# Altium project SOM Board with RK3399.PrjPcb (part 2 of 3)

## Sheet [7]-RK3399 SDRAM Page.SchDoc: RK3399 SOM Board Design V1.0
size A3; Author: ABC; Organization: Altium Limited; Address1: L3, 12a Rodborough Rd; Address2: Frenchs Forest; Address3: NSW; Address4: Australia 2086; DocumentNumber: 8; SheetNumber: 8; SheetTotal: 12; PROJECT CODE: A_V1.0
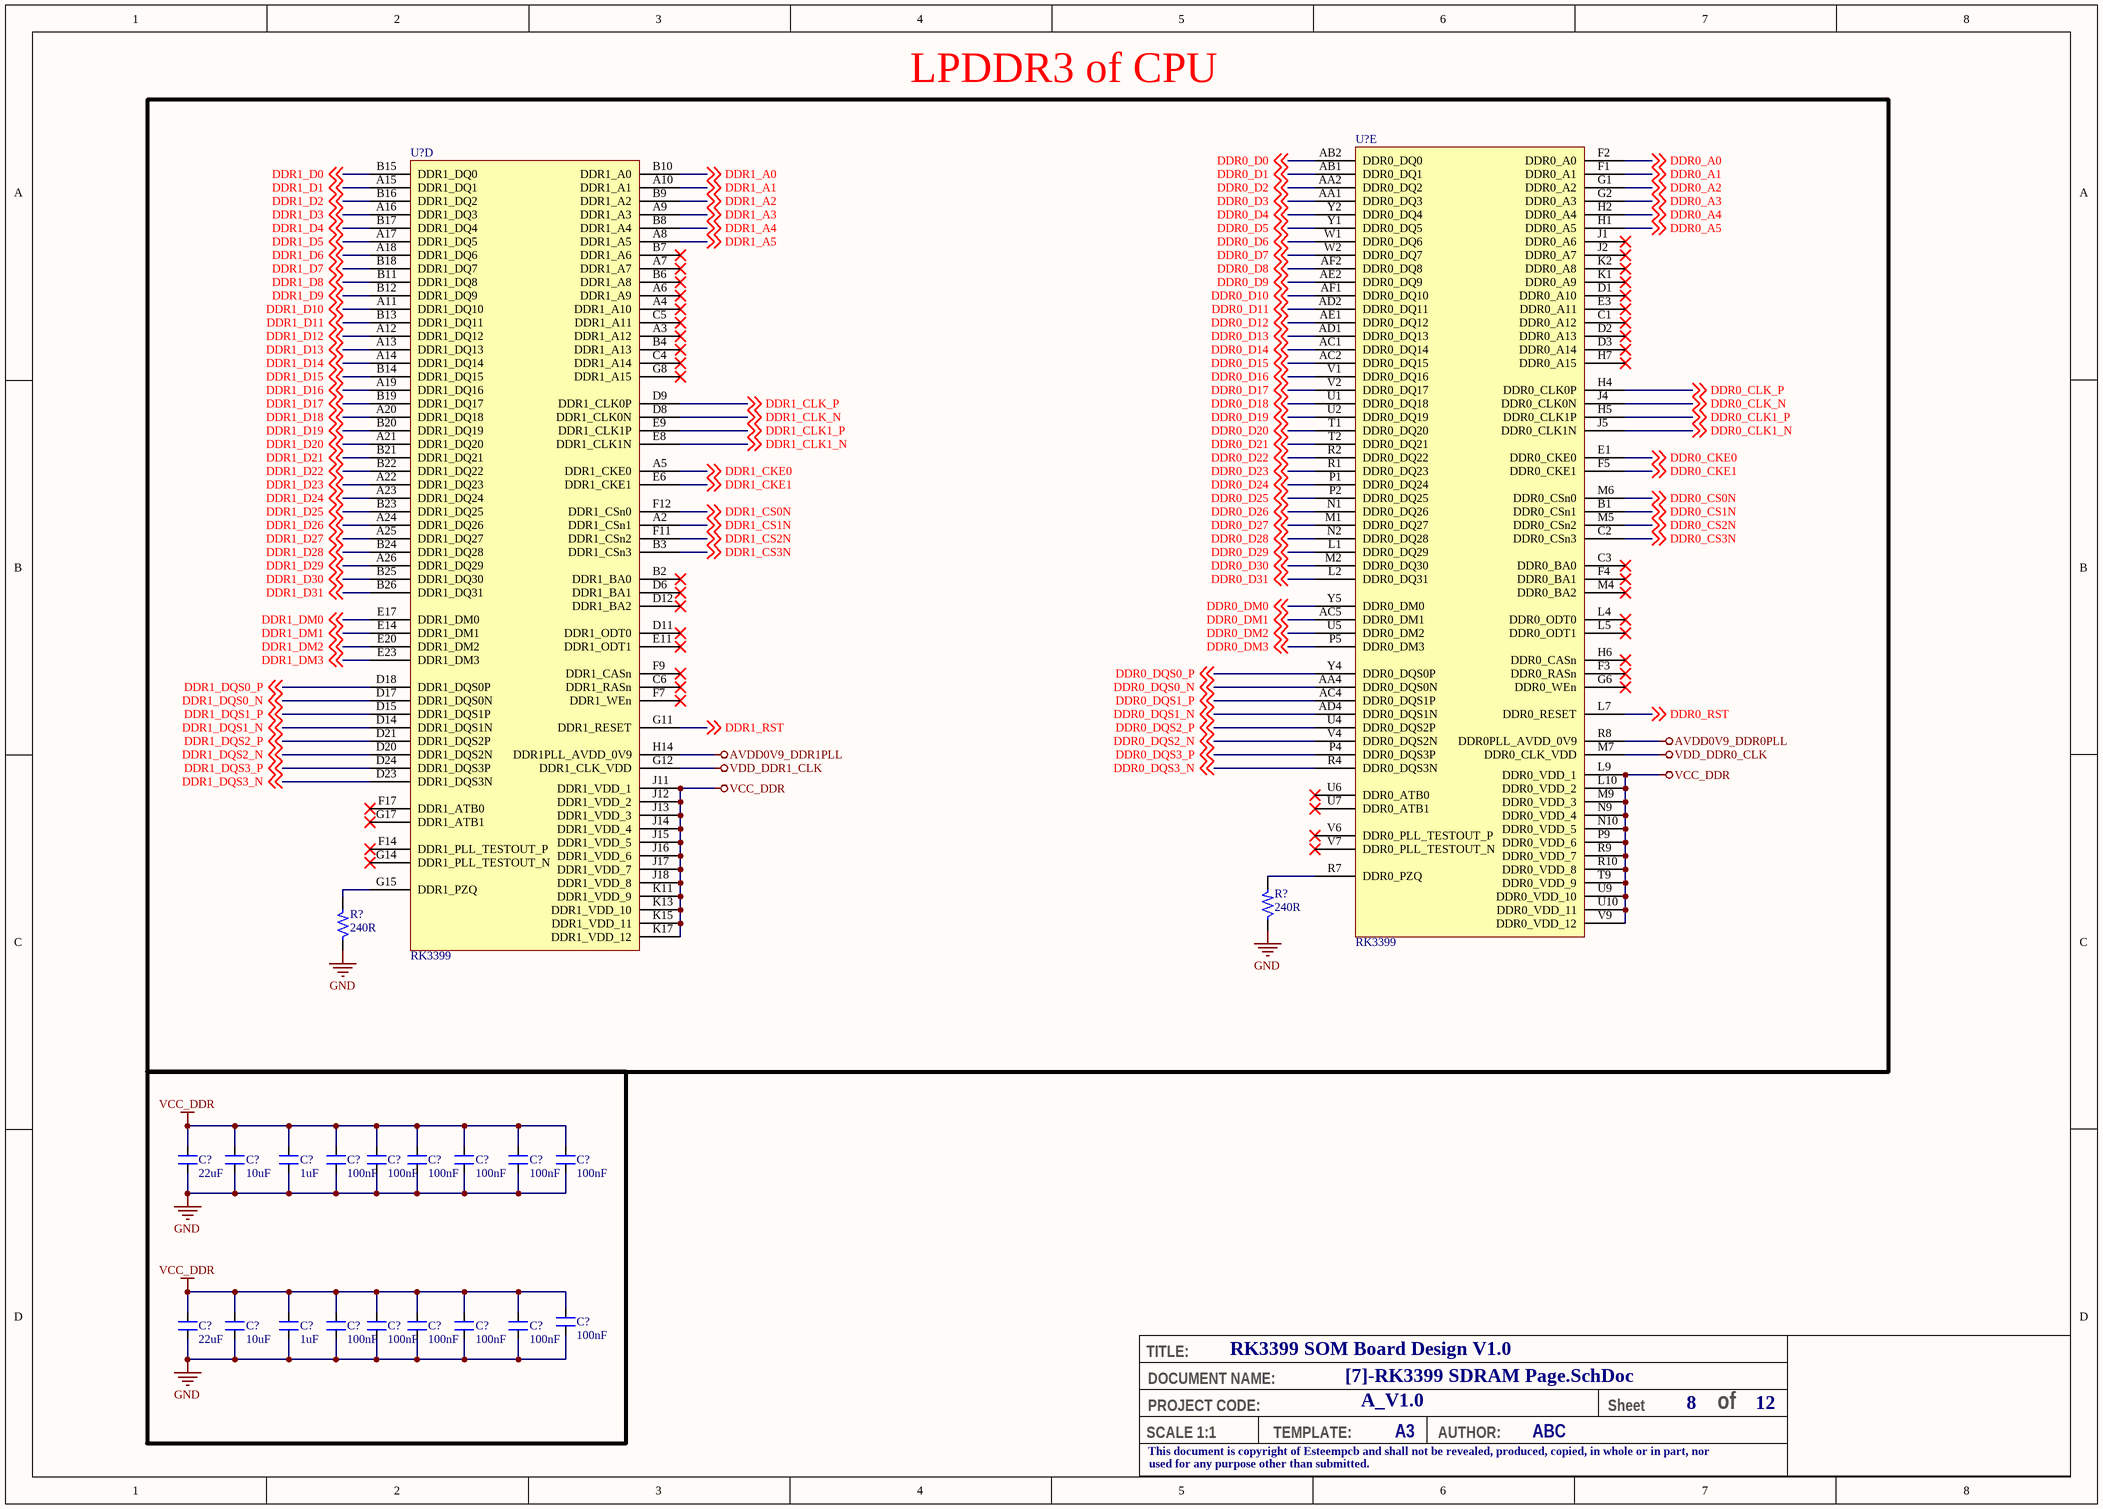
[diagram p7: [7]-RK3399 SDRAM Page.SchDoc]

### Parts
(Parts that share a designator on the sheet are numbered #1, #2 ... from top to bottom, then left to right.)
C?#101  22uF  [CAP_0402]
C?#102  10uF  [CAP_0402]
C?#103  1uF  [CAP_0201]
C?#104  100nF  [CAP_0201]
C?#105  100nF  [CAP_0201]
C?#106  100nF  [CAP_0201]
C?#107  100nF  [CAP_0201]
C?#108  100nF  [CAP_0201]
C?#109  100nF  [CAP_0201]
C?#110  100nF  [CAP_0201]
C?#111  22uF  [CAP_0402]
C?#112  10uF  [CAP_0402]
C?#113  1uF  [CAP_0201]
C?#114  100nF  [CAP_0201]
C?#115  100nF  [CAP_0201]
C?#116  100nF  [CAP_0201]
C?#117  100nF  [CAP_0201]
C?#118  100nF  [CAP_0201]
R?#45  240R  [RES_0201]
R?#46  240R  [RES_0201]
U?#22  RK3399  [FBGA828_23_826X826]  (part E of 24)
U?#23  RK3399  [FBGA828_23_826X826]  (part D of 24)

### Blocks framed on the sheet
LPDDR3 of CPU: R?#45 R?#46 U?#22 U?#23

### Nets
AVDD0V9_DDR0PLL: U?#22.R8(DDR0PLL_AVDD_0V9)
AVDD0V9_DDR1PLL: U?#23.H14(DDR1PLL_AVDD_0V9)
GND: C?#101.1 C?#102.1 C?#103.1 C?#104.1 C?#105.1 C?#106.1 C?#107.1 C?#108.1 C?#109.1 C?#110.1 C?#111.1 C?#112.1 C?#113.1 C?#114.1 C?#115.1 C?#116.1 C?#117.1 C?#118.1 R?#45.1 R?#46.1
VCC_DDR: C?#101.2 C?#102.2 C?#103.2 C?#104.2 C?#105.2 C?#106.2 C?#107.2 C?#108.2 C?#109.2 C?#110.2 C?#111.2 C?#112.2 C?#113.2 C?#114.2 C?#115.2 C?#116.2 C?#117.2 C?#118.2 U?#22.L9(DDR0_VDD_1) U?#22.L10(DDR0_VDD_2) U?#22.M9(DDR0_VDD_3) U?#22.N9(DDR0_VDD_4) U?#22.N10(DDR0_VDD_5) U?#22.P9(DDR0_VDD_6) U?#22.R9(DDR0_VDD_7) U?#22.R10(DDR0_VDD_8) U?#22.T9(DDR0_VDD_9) U?#22.U9(DDR0_VDD_10) U?#22.U10(DDR0_VDD_11) U?#22.V9(DDR0_VDD_12) U?#23.J11(DDR1_VDD_1) U?#23.J12(DDR1_VDD_2) U?#23.J13(DDR1_VDD_3) U?#23.J14(DDR1_VDD_4) U?#23.J15(DDR1_VDD_5) U?#23.J16(DDR1_VDD_6) U?#23.J17(DDR1_VDD_7) U?#23.J18(DDR1_VDD_8) U?#23.K11(DDR1_VDD_9) U?#23.K13(DDR1_VDD_10) U?#23.K15(DDR1_VDD_11) U?#23.K17(DDR1_VDD_12)
VDD_DDR0_CLK: U?#22.M7(DDR0_CLK_VDD)
VDD_DDR1_CLK: U?#23.G12(DDR1_CLK_VDD)
DDR0_A0: U?#22.F2(DDR0_A0) ; off-sheet DDR0_A0
DDR0_A1: U?#22.F1(DDR0_A1) ; off-sheet DDR0_A1
DDR0_A2: U?#22.G1(DDR0_A2) ; off-sheet DDR0_A2
DDR0_A3: U?#22.G2(DDR0_A3) ; off-sheet DDR0_A3
DDR0_A4: U?#22.H2(DDR0_A4) ; off-sheet DDR0_A4
DDR0_A5: U?#22.H1(DDR0_A5) ; off-sheet DDR0_A5
DDR0_CKE0: U?#22.E1(DDR0_CKE0) ; off-sheet DDR0_CKE0
DDR0_CKE1: U?#22.F5(DDR0_CKE1) ; off-sheet DDR0_CKE1
DDR0_CLK1_N: U?#22.J5(DDR0_CLK1N) ; off-sheet DDR0_CLK1_N
DDR0_CLK1_P: U?#22.H5(DDR0_CLK1P) ; off-sheet DDR0_CLK1_P
DDR0_CLK_N: U?#22.J4(DDR0_CLK0N) ; off-sheet DDR0_CLK_N
DDR0_CLK_P: U?#22.H4(DDR0_CLK0P) ; off-sheet DDR0_CLK_P
DDR0_CS0N: U?#22.M6(DDR0_CSn0) ; off-sheet DDR0_CS0N
DDR0_CS1N: U?#22.B1(DDR0_CSn1) ; off-sheet DDR0_CS1N
DDR0_CS2N: U?#22.M5(DDR0_CSn2) ; off-sheet DDR0_CS2N
DDR0_CS3N: U?#22.C2(DDR0_CSn3) ; off-sheet DDR0_CS3N
DDR0_D0: U?#22.AB2(DDR0_DQ0) ; off-sheet DDR0_D0
DDR0_D1: U?#22.AB1(DDR0_DQ1) ; off-sheet DDR0_D1
DDR0_D2: U?#22.AA2(DDR0_DQ2) ; off-sheet DDR0_D2
DDR0_D3: U?#22.AA1(DDR0_DQ3) ; off-sheet DDR0_D3
DDR0_D4: U?#22.Y2(DDR0_DQ4) ; off-sheet DDR0_D4
DDR0_D5: U?#22.Y1(DDR0_DQ5) ; off-sheet DDR0_D5
DDR0_D6: U?#22.W1(DDR0_DQ6) ; off-sheet DDR0_D6
DDR0_D7: U?#22.W2(DDR0_DQ7) ; off-sheet DDR0_D7
DDR0_D8: U?#22.AF2(DDR0_DQ8) ; off-sheet DDR0_D8
DDR0_D9: U?#22.AE2(DDR0_DQ9) ; off-sheet DDR0_D9
DDR0_D10: U?#22.AF1(DDR0_DQ10) ; off-sheet DDR0_D10
DDR0_D11: U?#22.AD2(DDR0_DQ11) ; off-sheet DDR0_D11
DDR0_D12: U?#22.AE1(DDR0_DQ12) ; off-sheet DDR0_D12
DDR0_D13: U?#22.AD1(DDR0_DQ13) ; off-sheet DDR0_D13
DDR0_D14: U?#22.AC1(DDR0_DQ14) ; off-sheet DDR0_D14
DDR0_D15: U?#22.AC2(DDR0_DQ15) ; off-sheet DDR0_D15
DDR0_D16: U?#22.V1(DDR0_DQ16) ; off-sheet DDR0_D16
DDR0_D17: U?#22.V2(DDR0_DQ17) ; off-sheet DDR0_D17
DDR0_D18: U?#22.U1(DDR0_DQ18) ; off-sheet DDR0_D18
DDR0_D19: U?#22.U2(DDR0_DQ19) ; off-sheet DDR0_D19
DDR0_D20: U?#22.T1(DDR0_DQ20) ; off-sheet DDR0_D20
DDR0_D21: U?#22.T2(DDR0_DQ21) ; off-sheet DDR0_D21
DDR0_D22: U?#22.R2(DDR0_DQ22) ; off-sheet DDR0_D22
DDR0_D23: U?#22.R1(DDR0_DQ23) ; off-sheet DDR0_D23
DDR0_D24: U?#22.P1(DDR0_DQ24) ; off-sheet DDR0_D24
DDR0_D25: U?#22.P2(DDR0_DQ25) ; off-sheet DDR0_D25
DDR0_D26: U?#22.N1(DDR0_DQ26) ; off-sheet DDR0_D26
DDR0_D27: U?#22.M1(DDR0_DQ27) ; off-sheet DDR0_D27
DDR0_D28: U?#22.N2(DDR0_DQ28) ; off-sheet DDR0_D28
DDR0_D29: U?#22.L1(DDR0_DQ29) ; off-sheet DDR0_D29
DDR0_D30: U?#22.M2(DDR0_DQ30) ; off-sheet DDR0_D30
DDR0_D31: U?#22.L2(DDR0_DQ31) ; off-sheet DDR0_D31
DDR0_DM0: U?#22.Y5(DDR0_DM0) ; off-sheet DDR0_DM0
DDR0_DM1: U?#22.AC5(DDR0_DM1) ; off-sheet DDR0_DM1
DDR0_DM2: U?#22.U5(DDR0_DM2) ; off-sheet DDR0_DM2
DDR0_DM3: U?#22.P5(DDR0_DM3) ; off-sheet DDR0_DM3
DDR0_DQS0_N: U?#22.AA4(DDR0_DQS0N) ; off-sheet DDR0_DQS0_N
DDR0_DQS0_P: U?#22.Y4(DDR0_DQS0P) ; off-sheet DDR0_DQS0_P
DDR0_DQS1_N: U?#22.AD4(DDR0_DQS1N) ; off-sheet DDR0_DQS1_N
DDR0_DQS1_P: U?#22.AC4(DDR0_DQS1P) ; off-sheet DDR0_DQS1_P
DDR0_DQS2_N: U?#22.V4(DDR0_DQS2N) ; off-sheet DDR0_DQS2_N
DDR0_DQS2_P: U?#22.U4(DDR0_DQS2P) ; off-sheet DDR0_DQS2_P
DDR0_DQS3_N: U?#22.R4(DDR0_DQS3N) ; off-sheet DDR0_DQS3_N
DDR0_DQS3_P: U?#22.P4(DDR0_DQS3P) ; off-sheet DDR0_DQS3_P
DDR0_RST: U?#22.L7(DDR0_RESET) ; off-sheet DDR0_RST
DDR1_A0: U?#23.B10(DDR1_A0) ; off-sheet DDR1_A0
DDR1_A1: U?#23.A10(DDR1_A1) ; off-sheet DDR1_A1
DDR1_A2: U?#23.B9(DDR1_A2) ; off-sheet DDR1_A2
DDR1_A3: U?#23.A9(DDR1_A3) ; off-sheet DDR1_A3
DDR1_A4: U?#23.B8(DDR1_A4) ; off-sheet DDR1_A4
DDR1_A5: U?#23.A8(DDR1_A5) ; off-sheet DDR1_A5
DDR1_CKE0: U?#23.A5(DDR1_CKE0) ; off-sheet DDR1_CKE0
DDR1_CKE1: U?#23.E6(DDR1_CKE1) ; off-sheet DDR1_CKE1
DDR1_CLK1_N: U?#23.E8(DDR1_CLK1N) ; off-sheet DDR1_CLK1_N
DDR1_CLK1_P: U?#23.E9(DDR1_CLK1P) ; off-sheet DDR1_CLK1_P
DDR1_CLK_N: U?#23.D8(DDR1_CLK0N) ; off-sheet DDR1_CLK_N
DDR1_CLK_P: U?#23.D9(DDR1_CLK0P) ; off-sheet DDR1_CLK_P
DDR1_CS0N: U?#23.F12(DDR1_CSn0) ; off-sheet DDR1_CS0N
DDR1_CS1N: U?#23.A2(DDR1_CSn1) ; off-sheet DDR1_CS1N
DDR1_CS2N: U?#23.F11(DDR1_CSn2) ; off-sheet DDR1_CS2N
DDR1_CS3N: U?#23.B3(DDR1_CSn3) ; off-sheet DDR1_CS3N
DDR1_D0: U?#23.B15(DDR1_DQ0) ; off-sheet DDR1_D0
DDR1_D1: U?#23.A15(DDR1_DQ1) ; off-sheet DDR1_D1
DDR1_D2: U?#23.B16(DDR1_DQ2) ; off-sheet DDR1_D2
DDR1_D3: U?#23.A16(DDR1_DQ3) ; off-sheet DDR1_D3
DDR1_D4: U?#23.B17(DDR1_DQ4) ; off-sheet DDR1_D4
DDR1_D5: U?#23.A17(DDR1_DQ5) ; off-sheet DDR1_D5
DDR1_D6: U?#23.A18(DDR1_DQ6) ; off-sheet DDR1_D6
DDR1_D7: U?#23.B18(DDR1_DQ7) ; off-sheet DDR1_D7
DDR1_D8: U?#23.B11(DDR1_DQ8) ; off-sheet DDR1_D8
DDR1_D9: U?#23.B12(DDR1_DQ9) ; off-sheet DDR1_D9
DDR1_D10: U?#23.A11(DDR1_DQ10) ; off-sheet DDR1_D10
DDR1_D11: U?#23.B13(DDR1_DQ11) ; off-sheet DDR1_D11
DDR1_D12: U?#23.A12(DDR1_DQ12) ; off-sheet DDR1_D12
DDR1_D13: U?#23.A13(DDR1_DQ13) ; off-sheet DDR1_D13
DDR1_D14: U?#23.A14(DDR1_DQ14) ; off-sheet DDR1_D14
DDR1_D15: U?#23.B14(DDR1_DQ15) ; off-sheet DDR1_D15
DDR1_D16: U?#23.A19(DDR1_DQ16) ; off-sheet DDR1_D16
DDR1_D17: U?#23.B19(DDR1_DQ17) ; off-sheet DDR1_D17
DDR1_D18: U?#23.A20(DDR1_DQ18) ; off-sheet DDR1_D18
DDR1_D19: U?#23.B20(DDR1_DQ19) ; off-sheet DDR1_D19
DDR1_D20: U?#23.A21(DDR1_DQ20) ; off-sheet DDR1_D20
DDR1_D21: U?#23.B21(DDR1_DQ21) ; off-sheet DDR1_D21
DDR1_D22: U?#23.B22(DDR1_DQ22) ; off-sheet DDR1_D22
DDR1_D23: U?#23.A22(DDR1_DQ23) ; off-sheet DDR1_D23
DDR1_D24: U?#23.A23(DDR1_DQ24) ; off-sheet DDR1_D24
DDR1_D25: U?#23.B23(DDR1_DQ25) ; off-sheet DDR1_D25
DDR1_D26: U?#23.A24(DDR1_DQ26) ; off-sheet DDR1_D26
DDR1_D27: U?#23.A25(DDR1_DQ27) ; off-sheet DDR1_D27
DDR1_D28: U?#23.B24(DDR1_DQ28) ; off-sheet DDR1_D28
DDR1_D29: U?#23.A26(DDR1_DQ29) ; off-sheet DDR1_D29
DDR1_D30: U?#23.B25(DDR1_DQ30) ; off-sheet DDR1_D30
DDR1_D31: U?#23.B26(DDR1_DQ31) ; off-sheet DDR1_D31
DDR1_DM0: U?#23.E17(DDR1_DM0) ; off-sheet DDR1_DM0
DDR1_DM1: U?#23.E14(DDR1_DM1) ; off-sheet DDR1_DM1
DDR1_DM2: U?#23.E20(DDR1_DM2) ; off-sheet DDR1_DM2
DDR1_DM3: U?#23.E23(DDR1_DM3) ; off-sheet DDR1_DM3
DDR1_DQS0_N: U?#23.D17(DDR1_DQS0N) ; off-sheet DDR1_DQS0_N
DDR1_DQS0_P: U?#23.D18(DDR1_DQS0P) ; off-sheet DDR1_DQS0_P
DDR1_DQS1_N: U?#23.D14(DDR1_DQS1N) ; off-sheet DDR1_DQS1_N
DDR1_DQS1_P: U?#23.D15(DDR1_DQS1P) ; off-sheet DDR1_DQS1_P
DDR1_DQS2_N: U?#23.D20(DDR1_DQS2N) ; off-sheet DDR1_DQS2_N
DDR1_DQS2_P: U?#23.D21(DDR1_DQS2P) ; off-sheet DDR1_DQS2_P
DDR1_DQS3_N: U?#23.D23(DDR1_DQS3N) ; off-sheet DDR1_DQS3_N
DDR1_DQS3_P: U?#23.D24(DDR1_DQS3P) ; off-sheet DDR1_DQS3_P
DDR1_RST: U?#23.G11(DDR1_RESET) ; off-sheet DDR1_RST
NetR?#45_2: R?#45.2 U?#22.R7(DDR0_PZQ)
NetR?#46_2: R?#46.2 U?#23.G15(DDR1_PZQ)

Not connected (* = marked no-connect by the designer): U?#22 C1(DDR0_A12)* C3(DDR0_BA0)* D1(DDR0_A10)* D2(DDR0_A13)* D3(DDR0_A14)* E3(DDR0_A11)* F3(DDR0_RASn)* F4(DDR0_BA1)* G6(DDR0_WEn)* H6(DDR0_CASn)* H7(DDR0_A15)* J1(DDR0_A6)* J2(DDR0_A7)* K1(DDR0_A9)* K2(DDR0_A8)* L4(DDR0_ODT0)* L5(DDR0_ODT1)* M4(DDR0_BA2)* U6(DDR0_ATB0)* U7(DDR0_ATB1)* V6(DDR0_PLL_TESTOUT_P)* V7(DDR0_PLL_TESTOUT_N)*; U?#23 A3(DDR1_A12)* A4(DDR1_A10)* A6(DDR1_A9)* A7(DDR1_A7)* B2(DDR1_BA0)* B4(DDR1_A13)* B6(DDR1_A8)* B7(DDR1_A6)* C4(DDR1_A14)* C5(DDR1_A11)* C6(DDR1_RASn)* D6(DDR1_BA1)* D11(DDR1_ODT0)* D12(DDR1_BA2)* E11(DDR1_ODT1)* F7(DDR1_WEn)* F9(DDR1_CASn)* F14(DDR1_PLL_TESTOUT_P)* F17(DDR1_ATB0)* G8(DDR1_A15)* G14(DDR1_PLL_TESTOUT_N)* G17(DDR1_ATB1)*

### Notes on the sheet
- TITLE:
- DOCUMENT NAME:
- SCALE 1:1
- This document is copyright of Esteempcb and shall not be revealed, produced, copied, in whole or in part, nor
- PROJECT CODE:
- TEMPLATE:
- A3
- AUTHOR:
- Sheet
- of
- used for any purpose other than submitted.

### Library data of the parts
C?#101 C?#111 = CAP_22uF-6.3V-20%-0402: as C?#6 on sheet [1]-Power Pins Page of RK3399; Case/Package: 0402; Supplier-1: Digikey
C?#102 C?#112 = CAP_10uF-10V-20%-0402: as C?#1 on sheet [1]-Power Pins Page of RK3399; Case/Package: 0402; Supplier-1: Digikey
C?#103 C?#113 = CAP_1uF-16V-10%-0201: as C?#8 on sheet [1]-Power Pins Page of RK3399; Case/Package: 0201; Supplier-1: Digikey
C?#104-C?#110 C?#114-C?#118 = CAP_100nF-25V-10%-0201: as C?#9 on sheet [1]-Power Pins Page of RK3399; Case/Package: 0201; Supplier-1: Digikey
R?#45 R?#46 = RES_240R-0.05W-1%-0201: 240 Ohms ±1% 0.05W, 1/20W Chip Resistor 0201 (0603 Metric) Thick Film /; Manufacturer: Yageo; Manufacturer Part Number: RC0201FR-07240RL; Case/Package: 0201; Supplier-1: Digikey
U?#22 U?#23 = IC_RK3399-FCBGA828: RK3399 is a low power, high performance processor for computing, personal mobile.; Manufacturer: Rockchip; Manufacturer Part Number: RK3399; Case/Package: FCBGA828; Supplier-1: Rockchip

## Sheet [8]-LPDDR4 SDRAM-1.SchDoc: RK3399 SOM Board Design V1.0
size A3; Author: ABC; Organization: Altium Limited; Address1: L3, 12a Rodborough Rd; Address2: Frenchs Forest; Address3: NSW; Address4: Australia 2086; DocumentNumber: 9; SheetNumber: 9; SheetTotal: 12; PROJECT CODE: A_V1.0
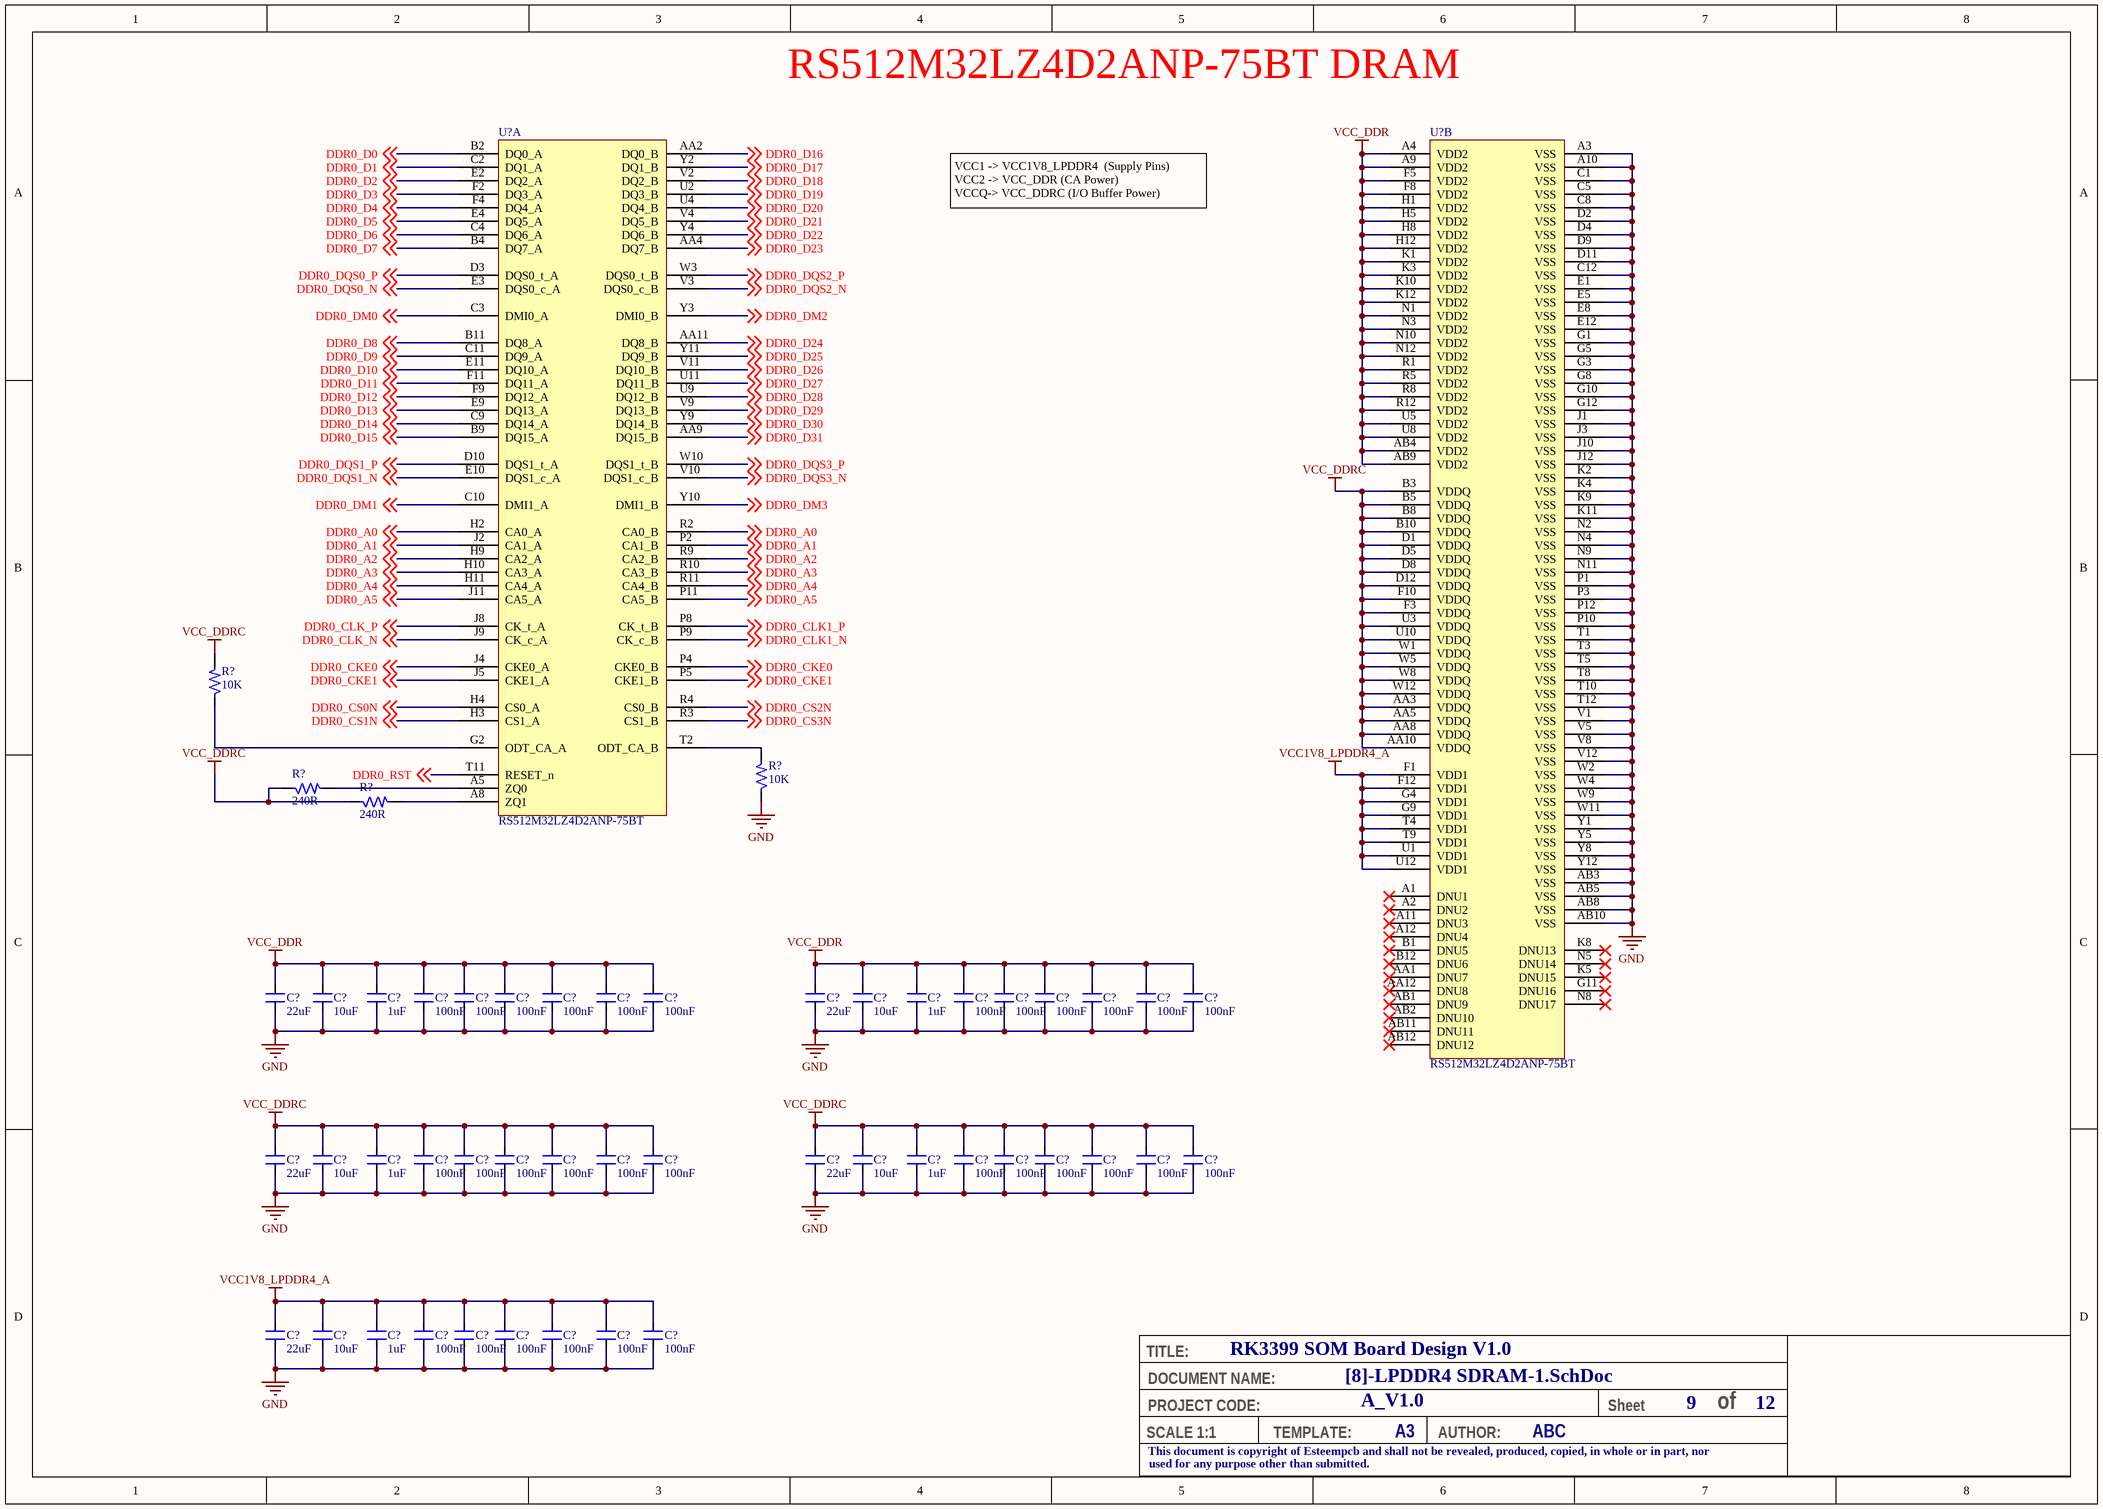
[diagram p8: [8]-LPDDR4 SDRAM-1.SchDoc]

### Parts
(Parts that share a designator on the sheet are numbered #1, #2 ... from top to bottom, then left to right.)
C?#119  22uF  [CAP_0402]
C?#120  10uF  [CAP_0402]
C?#121  1uF  [CAP_0201]
C?#122  100nF  [CAP_0201]
C?#123  100nF  [CAP_0201]
C?#124  100nF  [CAP_0201]
C?#125  100nF  [CAP_0201]
C?#126  100nF  [CAP_0201]
C?#127  100nF  [CAP_0201]
C?#128  22uF  [CAP_0402]
C?#129  10uF  [CAP_0402]
C?#130  1uF  [CAP_0201]
C?#131  100nF  [CAP_0201]
C?#132  100nF  [CAP_0201]
C?#133  100nF  [CAP_0201]
C?#134  100nF  [CAP_0201]
C?#135  100nF  [CAP_0201]
C?#136  100nF  [CAP_0201]
C?#137  22uF  [CAP_0402]
C?#138  10uF  [CAP_0402]
C?#139  1uF  [CAP_0201]
C?#140  100nF  [CAP_0201]
C?#141  100nF  [CAP_0201]
C?#142  100nF  [CAP_0201]
C?#143  100nF  [CAP_0201]
C?#144  100nF  [CAP_0201]
C?#145  100nF  [CAP_0201]
C?#146  22uF  [CAP_0402]
C?#147  10uF  [CAP_0402]
C?#148  1uF  [CAP_0201]
C?#149  100nF  [CAP_0201]
C?#150  100nF  [CAP_0201]
C?#151  100nF  [CAP_0201]
C?#152  100nF  [CAP_0201]
C?#153  100nF  [CAP_0201]
C?#154  100nF  [CAP_0201]
C?#155  22uF  [CAP_0402]
C?#156  10uF  [CAP_0402]
C?#157  1uF  [CAP_0201]
C?#158  100nF  [CAP_0201]
C?#159  100nF  [CAP_0201]
C?#160  100nF  [CAP_0201]
C?#161  100nF  [CAP_0201]
C?#162  100nF  [CAP_0201]
C?#163  100nF  [CAP_0201]
R?#47  10K  [RES_0201]
R?#48  240R  [RES_0201]
R?#49  240R  [RES_0201]
R?#50  10K  [RES_0201]
U?#24  RS512M32LZ4D2ANP-75BT  [FBGA200_SMD]  (part A of 2)
U?#25  RS512M32LZ4D2ANP-75BT  [FBGA200_SMD]  (part B of 2)

### Nets
GND: C?#119.1 C?#120.1 C?#121.1 C?#122.1 C?#123.1 C?#124.1 C?#125.1 C?#126.1 C?#127.1 C?#128.1 C?#129.1 C?#130.1 C?#131.1 C?#132.1 C?#133.1 C?#134.1 C?#135.1 C?#136.1 C?#137.1 C?#138.1 C?#139.1 C?#140.1 C?#141.1 C?#142.1 C?#143.1 C?#144.1 C?#145.1 C?#146.1 C?#147.1 C?#148.1 C?#149.1 C?#150.1 C?#151.1 C?#152.1 C?#153.1 C?#154.1 C?#155.1 C?#156.1 C?#157.1 C?#158.1 C?#159.1 C?#160.1 C?#161.1 C?#162.1 C?#163.1 R?#50.1 U?#25.A3(VSS) U?#25.A10(VSS) U?#25.AB3(VSS) U?#25.AB5(VSS) U?#25.AB8(VSS) U?#25.AB10(VSS) U?#25.C1(VSS) U?#25.C5(VSS) U?#25.C8(VSS) U?#25.C12(VSS) U?#25.D2(VSS) U?#25.D4(VSS) U?#25.D9(VSS) U?#25.D11(VSS) U?#25.E1(VSS) U?#25.E5(VSS) U?#25.E8(VSS) U?#25.E12(VSS) U?#25.G1(VSS) U?#25.G3(VSS) U?#25.G5(VSS) U?#25.G8(VSS) U?#25.G10(VSS) U?#25.G12(VSS) U?#25.J1(VSS) U?#25.J3(VSS) U?#25.J10(VSS) U?#25.J12(VSS) U?#25.K2(VSS) U?#25.K4(VSS) U?#25.K9(VSS) U?#25.K11(VSS) U?#25.N2(VSS) U?#25.N4(VSS) U?#25.N9(VSS) U?#25.N11(VSS) U?#25.P1(VSS) U?#25.P3(VSS) U?#25.P10(VSS) U?#25.P12(VSS) U?#25.T1(VSS) U?#25.T3(VSS) U?#25.T5(VSS) U?#25.T8(VSS) U?#25.T10(VSS) U?#25.T12(VSS) U?#25.V1(VSS) U?#25.V5(VSS) U?#25.V8(VSS) U?#25.V12(VSS) U?#25.W2(VSS) U?#25.W4(VSS) U?#25.W9(VSS) U?#25.W11(VSS) U?#25.Y1(VSS) U?#25.Y5(VSS) U?#25.Y8(VSS) U?#25.Y12(VSS)
VCC1V8_LPDDR4_A: C?#155.2 C?#156.2 C?#157.2 C?#158.2 C?#159.2 C?#160.2 C?#161.2 C?#162.2 C?#163.2 U?#25.F1(VDD1) U?#25.F12(VDD1) U?#25.G4(VDD1) U?#25.G9(VDD1) U?#25.T4(VDD1) U?#25.T9(VDD1) U?#25.U1(VDD1) U?#25.U12(VDD1)
VCC_DDR: C?#119.2 C?#120.2 C?#121.2 C?#122.2 C?#123.2 C?#124.2 C?#125.2 C?#126.2 C?#127.2 C?#128.2 C?#129.2 C?#130.2 C?#131.2 C?#132.2 C?#133.2 C?#134.2 C?#135.2 C?#136.2 U?#25.A4(VDD2) U?#25.A9(VDD2) U?#25.AB4(VDD2) U?#25.AB9(VDD2) U?#25.F5(VDD2) U?#25.F8(VDD2) U?#25.H1(VDD2) U?#25.H5(VDD2) U?#25.H8(VDD2) U?#25.H12(VDD2) U?#25.K1(VDD2) U?#25.K3(VDD2) U?#25.K10(VDD2) U?#25.K12(VDD2) U?#25.N1(VDD2) U?#25.N3(VDD2) U?#25.N10(VDD2) U?#25.N12(VDD2) U?#25.R1(VDD2) U?#25.R5(VDD2) U?#25.R8(VDD2) U?#25.R12(VDD2) U?#25.U5(VDD2) U?#25.U8(VDD2)
VCC_DDRC: C?#137.2 C?#138.2 C?#139.2 C?#140.2 C?#141.2 C?#142.2 C?#143.2 C?#144.2 C?#145.2 C?#146.2 C?#147.2 C?#148.2 C?#149.2 C?#150.2 C?#151.2 C?#152.2 C?#153.2 C?#154.2 R?#47.2 R?#48.1 R?#49.1 U?#25.AA3(VDDQ) U?#25.AA5(VDDQ) U?#25.AA8(VDDQ) U?#25.AA10(VDDQ) U?#25.B3(VDDQ) U?#25.B5(VDDQ) U?#25.B8(VDDQ) U?#25.B10(VDDQ) U?#25.D1(VDDQ) U?#25.D5(VDDQ) U?#25.D8(VDDQ) U?#25.D12(VDDQ) U?#25.F3(VDDQ) U?#25.F10(VDDQ) U?#25.U3(VDDQ) U?#25.U10(VDDQ) U?#25.W1(VDDQ) U?#25.W5(VDDQ) U?#25.W8(VDDQ) U?#25.W12(VDDQ)
DDR0_A0: U?#24.H2(CA0_A) U?#24.R2(CA0_B) ; off-sheet DDR0_A0
DDR0_A1: U?#24.J2(CA1_A) U?#24.P2(CA1_B) ; off-sheet DDR0_A1
DDR0_A2: U?#24.H9(CA2_A) U?#24.R9(CA2_B) ; off-sheet DDR0_A2
DDR0_A3: U?#24.H10(CA3_A) U?#24.R10(CA3_B) ; off-sheet DDR0_A3
DDR0_A4: U?#24.H11(CA4_A) U?#24.R11(CA4_B) ; off-sheet DDR0_A4
DDR0_A5: U?#24.J11(CA5_A) U?#24.P11(CA5_B) ; off-sheet DDR0_A5
DDR0_CKE0: U?#24.J4(CKE0_A) U?#24.P4(CKE0_B) ; off-sheet DDR0_CKE0
DDR0_CKE1: U?#24.J5(CKE1_A) U?#24.P5(CKE1_B) ; off-sheet DDR0_CKE1
DDR0_CLK1_N: U?#24.P9(CK_c_B) ; off-sheet DDR0_CLK1_N
DDR0_CLK1_P: U?#24.P8(CK_t_B) ; off-sheet DDR0_CLK1_P
DDR0_CLK_N: U?#24.J9(CK_c_A) ; off-sheet DDR0_CLK_N
DDR0_CLK_P: U?#24.J8(CK_t_A) ; off-sheet DDR0_CLK_P
DDR0_CS0N: U?#24.H4(CS0_A) ; off-sheet DDR0_CS0N
DDR0_CS1N: U?#24.H3(CS1_A) ; off-sheet DDR0_CS1N
DDR0_CS2N: U?#24.R4(CS0_B) ; off-sheet DDR0_CS2N
DDR0_CS3N: U?#24.R3(CS1_B) ; off-sheet DDR0_CS3N
DDR0_D0: U?#24.B2(DQ0_A) ; off-sheet DDR0_D0
DDR0_D1: U?#24.C2(DQ1_A) ; off-sheet DDR0_D1
DDR0_D2: U?#24.E2(DQ2_A) ; off-sheet DDR0_D2
DDR0_D3: U?#24.F2(DQ3_A) ; off-sheet DDR0_D3
DDR0_D4: U?#24.F4(DQ4_A) ; off-sheet DDR0_D4
DDR0_D5: U?#24.E4(DQ5_A) ; off-sheet DDR0_D5
DDR0_D6: U?#24.C4(DQ6_A) ; off-sheet DDR0_D6
DDR0_D7: U?#24.B4(DQ7_A) ; off-sheet DDR0_D7
DDR0_D8: U?#24.B11(DQ8_A) ; off-sheet DDR0_D8
DDR0_D9: U?#24.C11(DQ9_A) ; off-sheet DDR0_D9
DDR0_D10: U?#24.E11(DQ10_A) ; off-sheet DDR0_D10
DDR0_D11: U?#24.F11(DQ11_A) ; off-sheet DDR0_D11
DDR0_D12: U?#24.F9(DQ12_A) ; off-sheet DDR0_D12
DDR0_D13: U?#24.E9(DQ13_A) ; off-sheet DDR0_D13
DDR0_D14: U?#24.C9(DQ14_A) ; off-sheet DDR0_D14
DDR0_D15: U?#24.B9(DQ15_A) ; off-sheet DDR0_D15
DDR0_D16: U?#24.AA2(DQ0_B) ; off-sheet DDR0_D16
DDR0_D17: U?#24.Y2(DQ1_B) ; off-sheet DDR0_D17
DDR0_D18: U?#24.V2(DQ2_B) ; off-sheet DDR0_D18
DDR0_D19: U?#24.U2(DQ3_B) ; off-sheet DDR0_D19
DDR0_D20: U?#24.U4(DQ4_B) ; off-sheet DDR0_D20
DDR0_D21: U?#24.V4(DQ5_B) ; off-sheet DDR0_D21
DDR0_D22: U?#24.Y4(DQ6_B) ; off-sheet DDR0_D22
DDR0_D23: U?#24.AA4(DQ7_B) ; off-sheet DDR0_D23
DDR0_D24: U?#24.AA11(DQ8_B) ; off-sheet DDR0_D24
DDR0_D25: U?#24.Y11(DQ9_B) ; off-sheet DDR0_D25
DDR0_D26: U?#24.V11(DQ10_B) ; off-sheet DDR0_D26
DDR0_D27: U?#24.U11(DQ11_B) ; off-sheet DDR0_D27
DDR0_D28: U?#24.U9(DQ12_B) ; off-sheet DDR0_D28
DDR0_D29: U?#24.V9(DQ13_B) ; off-sheet DDR0_D29
DDR0_D30: U?#24.Y9(DQ14_B) ; off-sheet DDR0_D30
DDR0_D31: U?#24.AA9(DQ15_B) ; off-sheet DDR0_D31
DDR0_DM0: U?#24.C3(DMI0_A) ; off-sheet DDR0_DM0
DDR0_DM1: U?#24.C10(DMI1_A) ; off-sheet DDR0_DM1
DDR0_DM2: U?#24.Y3(DMI0_B) ; off-sheet DDR0_DM2
DDR0_DM3: U?#24.Y10(DMI1_B) ; off-sheet DDR0_DM3
DDR0_DQS0_N: U?#24.E3(DQS0_c_A) ; off-sheet DDR0_DQS0_N
DDR0_DQS0_P: U?#24.D3(DQS0_t_A) ; off-sheet DDR0_DQS0_P
DDR0_DQS1_N: U?#24.E10(DQS1_c_A) ; off-sheet DDR0_DQS1_N
DDR0_DQS1_P: U?#24.D10(DQS1_t_A) ; off-sheet DDR0_DQS1_P
DDR0_DQS2_N: U?#24.V3(DQS0_c_B) ; off-sheet DDR0_DQS2_N
DDR0_DQS2_P: U?#24.W3(DQS0_t_B) ; off-sheet DDR0_DQS2_P
DDR0_DQS3_N: U?#24.V10(DQS1_c_B) ; off-sheet DDR0_DQS3_N
DDR0_DQS3_P: U?#24.W10(DQS1_t_B) ; off-sheet DDR0_DQS3_P
DDR0_RST: U?#24.T11(RESET_n) ; off-sheet DDR0_RST
NetR?#47_1: R?#47.1 U?#24.G2(ODT_CA_A)
NetR?#48_2: R?#48.2 U?#24.A5(ZQ0)
NetR?#49_2: R?#49.2 U?#24.A8(ZQ1)
NetR?#50_2: R?#50.2 U?#24.T2(ODT_CA_B)

Not connected (* = marked no-connect by the designer): U?#25 A1(DNU1)* A2(DNU2)* A11(DNU3)* A12(DNU4)* AA1(DNU7)* AA12(DNU8)* AB1(DNU9)* AB2(DNU10)* AB11(DNU11)* AB12(DNU12)* B1(DNU5)* B12(DNU6)* G11(DNU16)* K5(DNU15)* K8(DNU13)* N5(DNU14)* N8(DNU17)*

### Notes on the sheet
- RS512M32LZ4D2ANP-75BT DRAM
- VCC1 -> VCC1V8_LPDDR4  (Supply Pins)
  VCC2 -> VCC_DDR (CA Power)
  VCCQ-> VCC_DDRC (I/O Buffer Power)
- TITLE:
- DOCUMENT NAME:
- SCALE 1:1
- This document is copyright of Esteempcb and shall not be revealed, produced, copied, in whole or in part, nor
- PROJECT CODE:
- TEMPLATE:
- A3
- AUTHOR:
- Sheet
- of
- used for any purpose other than submitted.

### Library data of the parts
C?#119 C?#128 C?#137 C?#146 C?#155 = CAP_22uF-6.3V-20%-0402: 22µF ±20% 6.3V Ceramic Capacitor X5R 0402 (1005 Metric) /; Manufacturer: Murata Electronics; Manufacturer Part Number: CL05A226MQ5N6J8; Case/Package: 0402; Supplier-1: Digikey
C?#120 C?#129 C?#138 C?#147 C?#156 = CAP_10uF-10V-20%-0402: 10µF ±20% 10V Ceramic Capacitor X5R 0402 (1005 Metric) /; Manufacturer Part Number: CL05A106MP5NUNC; Manufacturer: Samsung Electro-Mechanics; Case/Package: 0402; Supplier-1: Digikey
C?#121 C?#130 C?#139 C?#148 C?#157 = CAP_1uF-16V-10%-0201: 1µF ±20% 16V Ceramic Capacitor X5R 0201 (0603 Metric) /; Manufacturer: Samsung Electro-Mechanics; Manufacturer Part Number: CL03A105MO3NRNH; Case/Package: 0201; Supplier-1: Digikey
C?#122-C?#127 C?#131-C?#136 C?#140-C?#145 C?#149-C?#154 C?#158-C?#163 = CAP_100nF-25V-10%-0201: 0.1µF ±10% 25V Ceramic Capacitor X5R 0201 (0603 Metric) /; Manufacturer: TDK Corporation; Manufacturer Part Number: C0603X5R1E104K030BB; Case/Package: 0201; Supplier-1: Digikey
R?#47 R?#50 = RES_10K-0.05W-1%-0201: 10 kOhms ±1% 0.05W, 1/20W Chip Resistor 0201 (0603 Metric) Thick Film /; Manufacturer: Stackpole Electronics Inc; Manufacturer Part Number: RMCF0201FT10K0; Case/Package: 0201; Supplier-1: Digikey
R?#48 R?#49 = RES_240R-0.05W-1%-0201: 240 Ohms ±1% 0.05W, 1/20W Chip Resistor 0201 (0603 Metric) Thick Film /; Manufacturer: Yageo; Manufacturer Part Number: RC0201FR-07240RL; Case/Package: 0201; Supplier-1: Digikey
U?#24 U?#25 = IC_RS512M32LZ4D2ANP-75BT: LPDDR4/4X Package FBGA 200b Density 4Gbit~64Gbit Operating Temperature Range：-25~85℃ Speed：2667Mbps/3200Mbps/3733Mbps Voltage：VDD1/VDD2/VDDQ= 1.8 / 1.1 / 1.1 V（LPDDR4）VDD1/VDD2/VDDQ = 1.8 / 1.1 / 0.6 V（LPDDR4X）Approved Verification Platform：MTK、Spreadtrum; Manufacturer: RAYSON; Manufacturer Part Number: RS512M32LZ4D2ANP-75BT; Case/Package: FBGA 200b; Supplier-1: RAYSON

## Sheet [9]-LPDDR4 SDRAM-2.SchDoc: RK3399 SOM Board Design V1.0
size A3; Author: ABC; Organization: Altium Limited; Address1: L3, 12a Rodborough Rd; Address2: Frenchs Forest; Address3: NSW; Address4: Australia 2086; DocumentNumber: 10; SheetNumber: 10; SheetTotal: 12; PROJECT CODE: A_V1.0
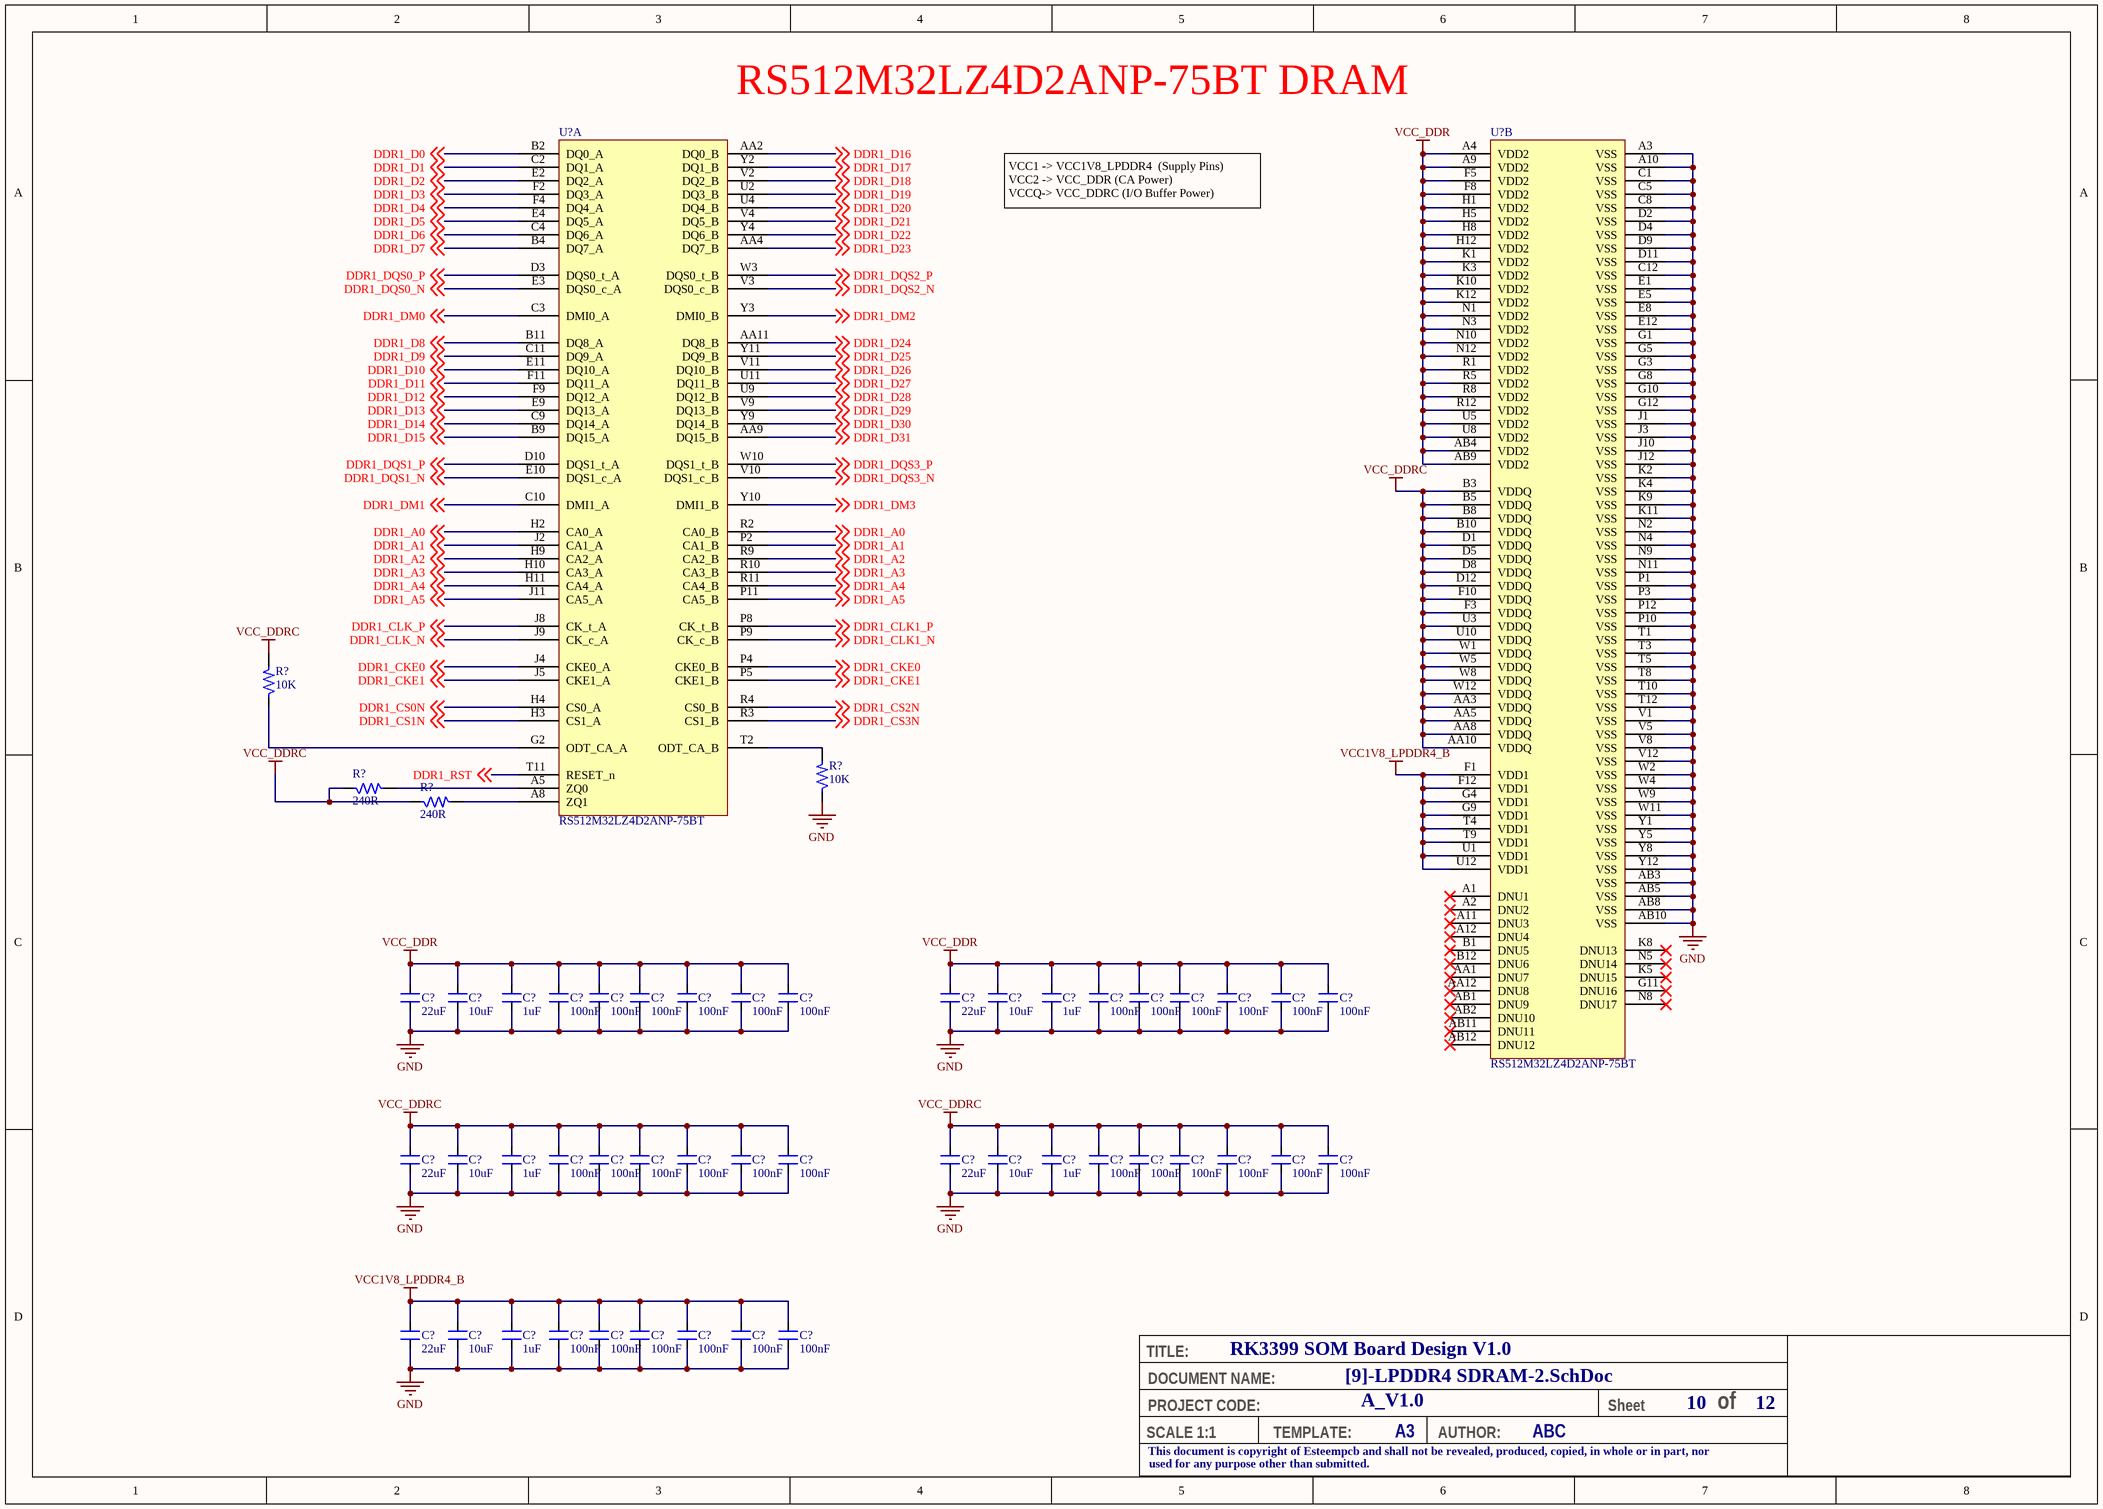
[diagram p9: [9]-LPDDR4 SDRAM-2.SchDoc]

### Parts
(Parts that share a designator on the sheet are numbered #1, #2 ... from top to bottom, then left to right.)
C?#164  22uF  [CAP_0402]
C?#165  10uF  [CAP_0402]
C?#166  1uF  [CAP_0201]
C?#167  100nF  [CAP_0201]
C?#168  100nF  [CAP_0201]
C?#169  100nF  [CAP_0201]
C?#170  100nF  [CAP_0201]
C?#171  100nF  [CAP_0201]
C?#172  100nF  [CAP_0201]
C?#173  22uF  [CAP_0402]
C?#174  10uF  [CAP_0402]
C?#175  1uF  [CAP_0201]
C?#176  100nF  [CAP_0201]
C?#177  100nF  [CAP_0201]
C?#178  100nF  [CAP_0201]
C?#179  100nF  [CAP_0201]
C?#180  100nF  [CAP_0201]
C?#181  100nF  [CAP_0201]
C?#182  22uF  [CAP_0402]
C?#183  10uF  [CAP_0402]
C?#184  1uF  [CAP_0201]
C?#185  100nF  [CAP_0201]
C?#186  100nF  [CAP_0201]
C?#187  100nF  [CAP_0201]
C?#188  100nF  [CAP_0201]
C?#189  100nF  [CAP_0201]
C?#190  100nF  [CAP_0201]
C?#191  22uF  [CAP_0402]
C?#192  10uF  [CAP_0402]
C?#193  1uF  [CAP_0201]
C?#194  100nF  [CAP_0201]
C?#195  100nF  [CAP_0201]
C?#196  100nF  [CAP_0201]
C?#197  100nF  [CAP_0201]
C?#198  100nF  [CAP_0201]
C?#199  100nF  [CAP_0201]
C?#200  22uF  [CAP_0402]
C?#201  10uF  [CAP_0402]
C?#202  1uF  [CAP_0201]
C?#203  100nF  [CAP_0201]
C?#204  100nF  [CAP_0201]
C?#205  100nF  [CAP_0201]
C?#206  100nF  [CAP_0201]
C?#207  100nF  [CAP_0201]
C?#208  100nF  [CAP_0201]
R?#51  10K  [RES_0201]
R?#52  240R  [RES_0201]
R?#53  240R  [RES_0201]
R?#54  10K  [RES_0201]
U?#26  RS512M32LZ4D2ANP-75BT  [FBGA200_SMD]  (part A of 2)
U?#27  RS512M32LZ4D2ANP-75BT  [FBGA200_SMD]  (part B of 2)

### Nets
GND: C?#164.1 C?#165.1 C?#166.1 C?#167.1 C?#168.1 C?#169.1 C?#170.1 C?#171.1 C?#172.1 C?#173.1 C?#174.1 C?#175.1 C?#176.1 C?#177.1 C?#178.1 C?#179.1 C?#180.1 C?#181.1 C?#182.1 C?#183.1 C?#184.1 C?#185.1 C?#186.1 C?#187.1 C?#188.1 C?#189.1 C?#190.1 C?#191.1 C?#192.1 C?#193.1 C?#194.1 C?#195.1 C?#196.1 C?#197.1 C?#198.1 C?#199.1 C?#200.1 C?#201.1 C?#202.1 C?#203.1 C?#204.1 C?#205.1 C?#206.1 C?#207.1 C?#208.1 R?#54.1 U?#27.A3(VSS) U?#27.A10(VSS) U?#27.AB3(VSS) U?#27.AB5(VSS) U?#27.AB8(VSS) U?#27.AB10(VSS) U?#27.C1(VSS) U?#27.C5(VSS) U?#27.C8(VSS) U?#27.C12(VSS) U?#27.D2(VSS) U?#27.D4(VSS) U?#27.D9(VSS) U?#27.D11(VSS) U?#27.E1(VSS) U?#27.E5(VSS) U?#27.E8(VSS) U?#27.E12(VSS) U?#27.G1(VSS) U?#27.G3(VSS) U?#27.G5(VSS) U?#27.G8(VSS) U?#27.G10(VSS) U?#27.G12(VSS) U?#27.J1(VSS) U?#27.J3(VSS) U?#27.J10(VSS) U?#27.J12(VSS) U?#27.K2(VSS) U?#27.K4(VSS) U?#27.K9(VSS) U?#27.K11(VSS) U?#27.N2(VSS) U?#27.N4(VSS) U?#27.N9(VSS) U?#27.N11(VSS) U?#27.P1(VSS) U?#27.P3(VSS) U?#27.P10(VSS) U?#27.P12(VSS) U?#27.T1(VSS) U?#27.T3(VSS) U?#27.T5(VSS) U?#27.T8(VSS) U?#27.T10(VSS) U?#27.T12(VSS) U?#27.V1(VSS) U?#27.V5(VSS) U?#27.V8(VSS) U?#27.V12(VSS) U?#27.W2(VSS) U?#27.W4(VSS) U?#27.W9(VSS) U?#27.W11(VSS) U?#27.Y1(VSS) U?#27.Y5(VSS) U?#27.Y8(VSS) U?#27.Y12(VSS)
VCC1V8_LPDDR4_B: C?#200.2 C?#201.2 C?#202.2 C?#203.2 C?#204.2 C?#205.2 C?#206.2 C?#207.2 C?#208.2 U?#27.F1(VDD1) U?#27.F12(VDD1) U?#27.G4(VDD1) U?#27.G9(VDD1) U?#27.T4(VDD1) U?#27.T9(VDD1) U?#27.U1(VDD1) U?#27.U12(VDD1)
VCC_DDR: C?#164.2 C?#165.2 C?#166.2 C?#167.2 C?#168.2 C?#169.2 C?#170.2 C?#171.2 C?#172.2 C?#173.2 C?#174.2 C?#175.2 C?#176.2 C?#177.2 C?#178.2 C?#179.2 C?#180.2 C?#181.2 U?#27.A4(VDD2) U?#27.A9(VDD2) U?#27.AB4(VDD2) U?#27.AB9(VDD2) U?#27.F5(VDD2) U?#27.F8(VDD2) U?#27.H1(VDD2) U?#27.H5(VDD2) U?#27.H8(VDD2) U?#27.H12(VDD2) U?#27.K1(VDD2) U?#27.K3(VDD2) U?#27.K10(VDD2) U?#27.K12(VDD2) U?#27.N1(VDD2) U?#27.N3(VDD2) U?#27.N10(VDD2) U?#27.N12(VDD2) U?#27.R1(VDD2) U?#27.R5(VDD2) U?#27.R8(VDD2) U?#27.R12(VDD2) U?#27.U5(VDD2) U?#27.U8(VDD2)
VCC_DDRC: C?#182.2 C?#183.2 C?#184.2 C?#185.2 C?#186.2 C?#187.2 C?#188.2 C?#189.2 C?#190.2 C?#191.2 C?#192.2 C?#193.2 C?#194.2 C?#195.2 C?#196.2 C?#197.2 C?#198.2 C?#199.2 R?#51.2 R?#52.1 R?#53.1 U?#27.AA3(VDDQ) U?#27.AA5(VDDQ) U?#27.AA8(VDDQ) U?#27.AA10(VDDQ) U?#27.B3(VDDQ) U?#27.B5(VDDQ) U?#27.B8(VDDQ) U?#27.B10(VDDQ) U?#27.D1(VDDQ) U?#27.D5(VDDQ) U?#27.D8(VDDQ) U?#27.D12(VDDQ) U?#27.F3(VDDQ) U?#27.F10(VDDQ) U?#27.U3(VDDQ) U?#27.U10(VDDQ) U?#27.W1(VDDQ) U?#27.W5(VDDQ) U?#27.W8(VDDQ) U?#27.W12(VDDQ)
DDR1_A0: U?#26.H2(CA0_A) U?#26.R2(CA0_B) ; off-sheet DDR1_A0
DDR1_A1: U?#26.J2(CA1_A) U?#26.P2(CA1_B) ; off-sheet DDR1_A1
DDR1_A2: U?#26.H9(CA2_A) U?#26.R9(CA2_B) ; off-sheet DDR1_A2
DDR1_A3: U?#26.H10(CA3_A) U?#26.R10(CA3_B) ; off-sheet DDR1_A3
DDR1_A4: U?#26.H11(CA4_A) U?#26.R11(CA4_B) ; off-sheet DDR1_A4
DDR1_A5: U?#26.J11(CA5_A) U?#26.P11(CA5_B) ; off-sheet DDR1_A5
DDR1_CKE0: U?#26.J4(CKE0_A) U?#26.P4(CKE0_B) ; off-sheet DDR1_CKE0
DDR1_CKE1: U?#26.J5(CKE1_A) U?#26.P5(CKE1_B) ; off-sheet DDR1_CKE1
DDR1_CLK1_N: U?#26.P9(CK_c_B) ; off-sheet DDR1_CLK1_N
DDR1_CLK1_P: U?#26.P8(CK_t_B) ; off-sheet DDR1_CLK1_P
DDR1_CLK_N: U?#26.J9(CK_c_A) ; off-sheet DDR1_CLK_N
DDR1_CLK_P: U?#26.J8(CK_t_A) ; off-sheet DDR1_CLK_P
DDR1_CS0N: U?#26.H4(CS0_A) ; off-sheet DDR1_CS0N
DDR1_CS1N: U?#26.H3(CS1_A) ; off-sheet DDR1_CS1N
DDR1_CS2N: U?#26.R4(CS0_B) ; off-sheet DDR1_CS2N
DDR1_CS3N: U?#26.R3(CS1_B) ; off-sheet DDR1_CS3N
DDR1_D0: U?#26.B2(DQ0_A) ; off-sheet DDR1_D0
DDR1_D1: U?#26.C2(DQ1_A) ; off-sheet DDR1_D1
DDR1_D2: U?#26.E2(DQ2_A) ; off-sheet DDR1_D2
DDR1_D3: U?#26.F2(DQ3_A) ; off-sheet DDR1_D3
DDR1_D4: U?#26.F4(DQ4_A) ; off-sheet DDR1_D4
DDR1_D5: U?#26.E4(DQ5_A) ; off-sheet DDR1_D5
DDR1_D6: U?#26.C4(DQ6_A) ; off-sheet DDR1_D6
DDR1_D7: U?#26.B4(DQ7_A) ; off-sheet DDR1_D7
DDR1_D8: U?#26.B11(DQ8_A) ; off-sheet DDR1_D8
DDR1_D9: U?#26.C11(DQ9_A) ; off-sheet DDR1_D9
DDR1_D10: U?#26.E11(DQ10_A) ; off-sheet DDR1_D10
DDR1_D11: U?#26.F11(DQ11_A) ; off-sheet DDR1_D11
DDR1_D12: U?#26.F9(DQ12_A) ; off-sheet DDR1_D12
DDR1_D13: U?#26.E9(DQ13_A) ; off-sheet DDR1_D13
DDR1_D14: U?#26.C9(DQ14_A) ; off-sheet DDR1_D14
DDR1_D15: U?#26.B9(DQ15_A) ; off-sheet DDR1_D15
DDR1_D16: U?#26.AA2(DQ0_B) ; off-sheet DDR1_D16
DDR1_D17: U?#26.Y2(DQ1_B) ; off-sheet DDR1_D17
DDR1_D18: U?#26.V2(DQ2_B) ; off-sheet DDR1_D18
DDR1_D19: U?#26.U2(DQ3_B) ; off-sheet DDR1_D19
DDR1_D20: U?#26.U4(DQ4_B) ; off-sheet DDR1_D20
DDR1_D21: U?#26.V4(DQ5_B) ; off-sheet DDR1_D21
DDR1_D22: U?#26.Y4(DQ6_B) ; off-sheet DDR1_D22
DDR1_D23: U?#26.AA4(DQ7_B) ; off-sheet DDR1_D23
DDR1_D24: U?#26.AA11(DQ8_B) ; off-sheet DDR1_D24
DDR1_D25: U?#26.Y11(DQ9_B) ; off-sheet DDR1_D25
DDR1_D26: U?#26.V11(DQ10_B) ; off-sheet DDR1_D26
DDR1_D27: U?#26.U11(DQ11_B) ; off-sheet DDR1_D27
DDR1_D28: U?#26.U9(DQ12_B) ; off-sheet DDR1_D28
DDR1_D29: U?#26.V9(DQ13_B) ; off-sheet DDR1_D29
DDR1_D30: U?#26.Y9(DQ14_B) ; off-sheet DDR1_D30
DDR1_D31: U?#26.AA9(DQ15_B) ; off-sheet DDR1_D31
DDR1_DM0: U?#26.C3(DMI0_A) ; off-sheet DDR1_DM0
DDR1_DM1: U?#26.C10(DMI1_A) ; off-sheet DDR1_DM1
DDR1_DM2: U?#26.Y3(DMI0_B) ; off-sheet DDR1_DM2
DDR1_DM3: U?#26.Y10(DMI1_B) ; off-sheet DDR1_DM3
DDR1_DQS0_N: U?#26.E3(DQS0_c_A) ; off-sheet DDR1_DQS0_N
DDR1_DQS0_P: U?#26.D3(DQS0_t_A) ; off-sheet DDR1_DQS0_P
DDR1_DQS1_N: U?#26.E10(DQS1_c_A) ; off-sheet DDR1_DQS1_N
DDR1_DQS1_P: U?#26.D10(DQS1_t_A) ; off-sheet DDR1_DQS1_P
DDR1_DQS2_N: U?#26.V3(DQS0_c_B) ; off-sheet DDR1_DQS2_N
DDR1_DQS2_P: U?#26.W3(DQS0_t_B) ; off-sheet DDR1_DQS2_P
DDR1_DQS3_N: U?#26.V10(DQS1_c_B) ; off-sheet DDR1_DQS3_N
DDR1_DQS3_P: U?#26.W10(DQS1_t_B) ; off-sheet DDR1_DQS3_P
DDR1_RST: U?#26.T11(RESET_n) ; off-sheet DDR1_RST
NetR?#51_1: R?#51.1 U?#26.G2(ODT_CA_A)
NetR?#52_2: R?#52.2 U?#26.A5(ZQ0)
NetR?#53_2: R?#53.2 U?#26.A8(ZQ1)
NetR?#54_2: R?#54.2 U?#26.T2(ODT_CA_B)

Not connected (* = marked no-connect by the designer): U?#27 A1(DNU1)* A2(DNU2)* A11(DNU3)* A12(DNU4)* AA1(DNU7)* AA12(DNU8)* AB1(DNU9)* AB2(DNU10)* AB11(DNU11)* AB12(DNU12)* B1(DNU5)* B12(DNU6)* G11(DNU16)* K5(DNU15)* K8(DNU13)* N5(DNU14)* N8(DNU17)*

### Notes on the sheet
- (near U?#26) RS512M32LZ4D2ANP-75BT DRAM
- VCC1 -> VCC1V8_LPDDR4  (Supply Pins)
  VCC2 -> VCC_DDR (CA Power)
  VCCQ-> VCC_DDRC (I/O Buffer Power)
- TITLE:
- DOCUMENT NAME:
- SCALE 1:1
- This document is copyright of Esteempcb and shall not be revealed, produced, copied, in whole or in part, nor
- PROJECT CODE:
- TEMPLATE:
- A3
- AUTHOR:
- Sheet
- of
- used for any purpose other than submitted.

### Library data of the parts
C?#164 C?#173 C?#182 C?#191 C?#200 = CAP_22uF-6.3V-20%-0402: as C?#119 on sheet [8]-LPDDR4 SDRAM-1; Case/Package: 0402; Supplier-1: Digikey
C?#165 C?#174 C?#183 C?#192 C?#201 = CAP_10uF-10V-20%-0402: as C?#120 on sheet [8]-LPDDR4 SDRAM-1; Case/Package: 0402; Supplier-1: Digikey
C?#166 C?#175 C?#184 C?#193 C?#202 = CAP_1uF-16V-10%-0201: as C?#121 on sheet [8]-LPDDR4 SDRAM-1; Case/Package: 0201; Supplier-1: Digikey
C?#167-C?#172 C?#176-C?#181 C?#185-C?#190 C?#194-C?#199 C?#203-C?#208 = CAP_100nF-25V-10%-0201: as C?#122-C?#127 on sheet [8]-LPDDR4 SDRAM-1; Case/Package: 0201; Supplier-1: Digikey
R?#51 R?#54 = RES_10K-0.05W-1%-0201: as R?#47 on sheet [8]-LPDDR4 SDRAM-1; Case/Package: 0201; Supplier-1: Digikey
R?#52 R?#53 = RES_240R-0.05W-1%-0201: as R?#48 on sheet [8]-LPDDR4 SDRAM-1; Case/Package: 0201; Supplier-1: Digikey
U?#26 U?#27 = IC_RS512M32LZ4D2ANP-75BT: as U?#24 on sheet [8]-LPDDR4 SDRAM-1; Manufacturer Part Number: RS512M32LZ4D2ANP-75BT; Case/Package: FBGA 200b; Supplier-1: RAYSON

## Sheet [10]-EMMC Chip.SchDoc: RK3399 SOM Board Design V1.0
size A4; Author: AVIRAL MISHRA; DocumentNumber: 11; SheetNumber: 11; SheetTotal: 12; PROJECT CODE: A_V1.0
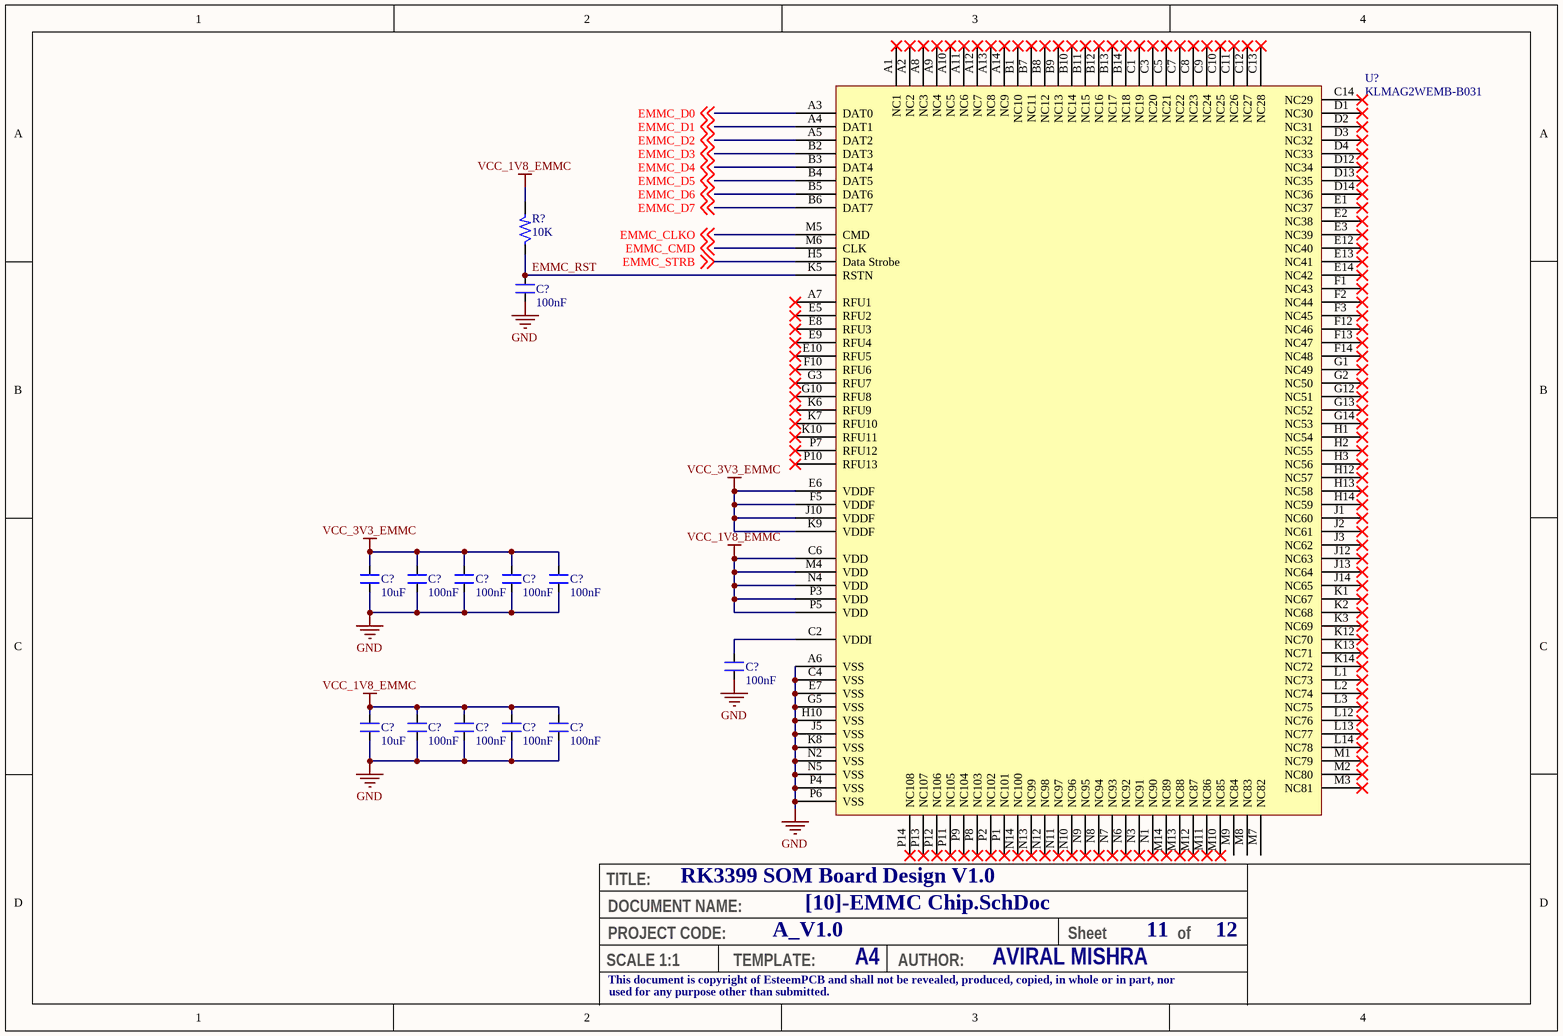
[diagram p10: [10]-EMMC Chip.SchDoc]

### Parts
(Parts that share a designator on the sheet are numbered #1, #2 ... from top to bottom, then left to right.)
C?#209  100nF  [CAP_0201]
C?#210  10uF  [CAP_0603]
C?#211  100nF  [CAP_0201]
C?#212  100nF  [CAP_0201]
C?#213  100nF  [CAP_0201]
C?#214  100nF  [CAP_0201]
C?#215  100nF  [CAP_0201]
C?#216  10uF  [CAP_0603]
C?#217  100nF  [CAP_0201]
C?#218  100nF  [CAP_0201]
C?#219  100nF  [CAP_0201]
C?#220  100nF  [CAP_0201]
R?#55  10K  [RES_0201]
U?#28  KLMAG2WEMB-B031  [BGA153C50P14X14_1150X1300X70]

### Nets
GND: C?#209.1 C?#210.1 C?#211.1 C?#212.1 C?#213.1 C?#214.1 C?#215.1 C?#216.1 C?#217.1 C?#218.1 C?#219.1 C?#220.1 U?#28.A6(VSS) U?#28.C4(VSS) U?#28.E7(VSS) U?#28.G5(VSS) U?#28.H10(VSS) U?#28.J5(VSS) U?#28.K8(VSS) U?#28.N2(VSS) U?#28.N5(VSS) U?#28.P4(VSS) U?#28.P6(VSS)
VCC_1V8_EMMC: C?#216.2 C?#217.2 C?#218.2 C?#219.2 C?#220.2 R?#55.2 U?#28.C6(VDD) U?#28.M4(VDD) U?#28.N4(VDD) U?#28.P3(VDD) U?#28.P5(VDD)
VCC_3V3_EMMC: C?#210.2 C?#211.2 C?#212.2 C?#213.2 C?#214.2 U?#28.E6(VDDF) U?#28.F5(VDDF) U?#28.J10(VDDF) U?#28.K9(VDDF)
EMMC_CLKO: U?#28.M5(CMD) ; off-sheet EMMC_CLKO
EMMC_CMD: U?#28.M6(CLK) ; off-sheet EMMC_CMD
EMMC_D0: U?#28.A3(DAT0) ; off-sheet EMMC_D0
EMMC_D1: U?#28.A4(DAT1) ; off-sheet EMMC_D1
EMMC_D2: U?#28.A5(DAT2) ; off-sheet EMMC_D2
EMMC_D3: U?#28.B2(DAT3) ; off-sheet EMMC_D3
EMMC_D4: U?#28.B3(DAT4) ; off-sheet EMMC_D4
EMMC_D5: U?#28.B4(DAT5) ; off-sheet EMMC_D5
EMMC_D6: U?#28.B5(DAT6) ; off-sheet EMMC_D6
EMMC_D7: U?#28.B6(DAT7) ; off-sheet EMMC_D7
EMMC_RST: C?#209.2 R?#55.1 U?#28.K5(RSTN)
EMMC_STRB: U?#28.H5(Data_Strobe) ; off-sheet EMMC_STRB
NetC?#215_2: C?#215.2 U?#28.C2(VDDI)

Not connected (* = marked no-connect by the designer): U?#28 A1(NC1)* A2(NC2)* A7(RFU1)* A8(NC3)* A9(NC4)* A10(NC5)* A11(NC6)* A12(NC7)* A13(NC8)* A14(NC9)* B1(NC10)* B7(NC11)* B8(NC12)* B9(NC13)* B10(NC14)* B11(NC15)* B12(NC16)* B13(NC17)* B14(NC18)* C1(NC19)* C3(NC20)* C5(NC21)* C7(NC22)* C8(NC23)* C9(NC24)* C10(NC25)* C11(NC26)* C12(NC27)* C13(NC28)* C14(NC29)* D1(NC30)* D2(NC31)* D3(NC32)* D4(NC33)* D12(NC34)* D13(NC35)* D14(NC36)* E1(NC37)* E2(NC38)* E3(NC39)* E5(RFU2)* E8(RFU3)* E9(RFU4)* E10(RFU5)* E12(NC40)* E13(NC41)* E14(NC42)* F1(NC43)* F2(NC44)* F3(NC45)* F10(RFU6)* F12(NC46)* F13(NC47)* F14(NC48)* G1(NC49)* G2(NC50)* G3(RFU7)* G10(RFU8)* G12(NC51)* G13(NC52)* G14(NC53)* H1(NC54)* H2(NC55)* H3(NC56)* H12(NC57)* H13(NC58)* H14(NC59)* J1(NC60)* J2(NC61)* J3(NC62)* J12(NC63)* J13(NC64)* J14(NC65)* K1(NC67)* K2(NC68)* K3(NC69)* K6(RFU9)* K7(RFU10)* K10(RFU11)* K12(NC70)* K13(NC71)* K14(NC72)* L1(NC73)* L2(NC74)* L3(NC75)* L12(NC76)* L13(NC77)* L14(NC78)* M1(NC79)* M2(NC80)* M3(NC81)* M7(NC82) M8(NC83) M9(NC84) M10(NC85)* M11(NC86)* M12(NC87)* M13(NC88)* M14(NC89)* N1(NC90)* N3(NC91)* N6(NC92)* N7(NC93)* N8(NC94)* N9(NC95)* N10(NC96)* N11(NC97)* N12(NC98)* N13(NC99)* N14(NC100)* P1(NC101)* P2(NC102)* P7(RFU12)* P8(NC103)* P9(NC104)* P10(RFU13)* P11(NC105)* P12(NC106)* P13(NC107)* P14(NC108)*

### Notes on the sheet
- TITLE:
- DOCUMENT NAME:
- SCALE 1:1
- This document is copyright of EsteemPCB and shall not be revealed, produced, copied, in whole or in part, nor
- PROJECT CODE:
- TEMPLATE:
- A4
- AUTHOR:
- Sheet
- of
- used for any purpose other than submitted.

### Library data of the parts
C?#209 C?#211-C?#215 C?#217-C?#220 = CAP_100nF-25V-10%-0201: as C?#122-C?#127 on sheet [8]-LPDDR4 SDRAM-1; Case/Package: 0201; Supplier-1: Digikey
C?#210 C?#216 = CAP_10uF-10V-10%-0603: 10µF ±10% 10V Ceramic Capacitor X5R 0603 (1608 Metric) /; Manufacturer Part Number: GRM188R61A106KE69J; Manufacturer: Murata Electronics; Case/Package: 0603; Supplier-1: Digikey
R?#55 = RES_10K-0.05W-1%-0201: as R?#47 on sheet [8]-LPDDR4 SDRAM-1; Case/Package: 0201; Supplier-1: Digikey
U?#28 = IC_KLMAG2WEMB-B031: 16GB NAND Flash Memory; Manufacturer: Samsung Electronics; Manufacturer Part Number: KLMAG2WEMB-B031; Case/Package: 153-FBGA; Supplier-1: NA

## Sheet [11]-WIFI Module WF60.SchDoc: RK3399 SOM Board Design V1.0
size A4; Author: AVIRAL MISHRA; DocumentNumber: 12; SheetNumber: 12; SheetTotal: 12; PROJECT CODE: A_V1.0
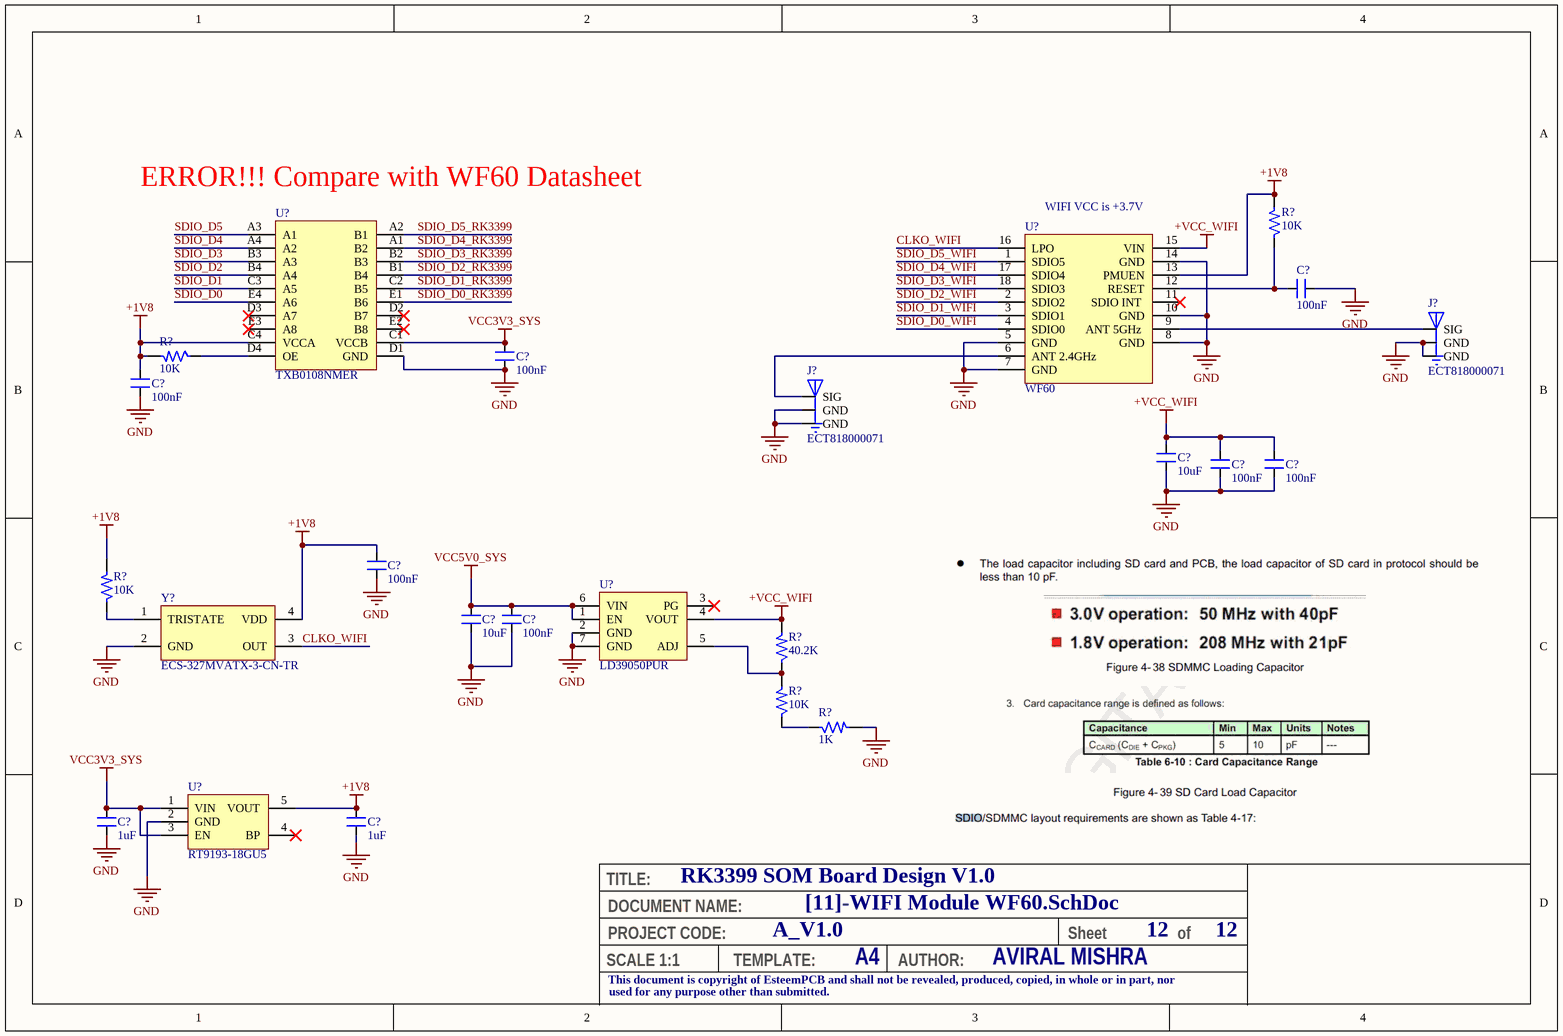
[diagram p11: [11]-WIFI Module WF60.SchDoc]

### Parts
(Parts that share a designator on the sheet are numbered #1, #2 ... from top to bottom, then left to right.)
C?#221  100nF  [CAP_0201]
C?#222  100nF  [CAP_0201]
C?#223  100nF  [CAP_0201]
C?#224  10uF  [CAP_0603]
C?#225  100nF  [CAP_0201]
C?#226  100nF  [CAP_0201]
C?#227  100nF  [CAP_0201]
C?#228  10uF  [CAP_0603]
C?#229  100nF  [CAP_0201]
C?#230  1uF  [CAP_0201]
C?#231  1uF  [CAP_0201]
J?#1  ECT818000071  [CON3_UFL_116_SMD_ST]
J?#2  ECT818000071  [CON3_UFL_116_SMD_ST]
R?#56  10K  [RES_0201]
R?#57  10K  [RES_0201]
R?#58  10K  [RES_0201]
R?#59  40.2K  [RES_0201]
R?#60  10K  [RES_0201]
R?#61  1K  [RES_0201]
U?#29  TXB0108NMER  [NFBGA_31.4_125.9X102.36]
U?#30  WF60  [MOD_WF60]
U?#31  LD39050PUR  [DFN-6_37.4_165_33X15_SMD]
U?#32  RT9193-18GU5  [SC70-5]
Y?  ECS-327MVATX-3-CN-TR  [XTAL_57_35X31_SMD]

### Nets
+1V8: C?#223.2 C?#227.2 C?#231.2 R?#56.2 R?#57.2 R?#58.2 U?#29.C4(VCCA) U?#30.13(PMUEN) U?#32.5(VOUT) Y?.4(VDD)
+VCC_WIFI: C?#224.2 C?#225.2 C?#226.2 R?#59.2 U?#30.15(VIN) U?#31.4(VOUT)
GND: C?#221.1 C?#222.1 C?#223.1 C?#224.1 C?#225.1 C?#226.1 C?#227.1 C?#228.1 C?#229.1 C?#230.1 C?#231.1 J?#1.1(GND) J?#1.3(GND) J?#2.1(GND) J?#2.3(GND) R?#61.2 U?#29.D1(GND) U?#30.5(GND) U?#30.7(GND) U?#30.8(GND) U?#30.10(GND) U?#30.14(GND) U?#31.2(GND) U?#31.7(GND) U?#32.2(GND) Y?.2(GND)
VCC3V3_SYS: C?#222.2 C?#230.2 U?#29.C1(VCCB) U?#32.1(VIN) U?#32.3(EN)
VCC5V0_SYS: C?#228.2 C?#229.2 U?#31.1(EN) U?#31.6(VIN)
CLKO_WIFI: U?#30.16(LPO) Y?.3(OUT)
SDIO_D0: U?#29.E4(A6)
SDIO_D0_RK3399: U?#29.E1(B6)
SDIO_D0_WIFI: U?#30.4(SDIO0)
SDIO_D1: U?#29.C3(A5)
SDIO_D1_RK3399: U?#29.C2(B5)
SDIO_D1_WIFI: U?#30.3(SDIO1)
SDIO_D2: U?#29.B4(A4)
SDIO_D2_RK3399: U?#29.B1(B4)
SDIO_D2_WIFI: U?#30.2(SDIO2)
SDIO_D3: U?#29.B3(A3)
SDIO_D3_RK3399: U?#29.B2(B3)
SDIO_D3_WIFI: U?#30.18(SDIO3)
SDIO_D4: U?#29.A4(A2)
SDIO_D4_RK3399: U?#29.A1(B2)
SDIO_D4_WIFI: U?#30.17(SDIO4)
SDIO_D5: U?#29.A3(A1)
SDIO_D5_RK3399: U?#29.A2(B1)
SDIO_D5_WIFI: U?#30.1(SDIO5)
NetC?#221_2: C?#221.2 R?#56.1 U?#30.12(RESET)
NetJ?#1_2: J?#1.2(SIG) U?#30.9(ANT_5GHz)
NetJ?#2_2: J?#2.2(SIG) U?#30.6(ANT_2.4GHz)
NetR?#57_1: R?#57.1 U?#29.D4(OE)
NetR?#58_1: R?#58.1 Y?.1(TRISTATE)
NetR?#59_1: R?#59.1 R?#60.2 U?#31.5(ADJ)
NetR?#60_1: R?#60.1 R?#61.1

Not connected (* = marked no-connect by the designer): U?#29 D2(B7)* D3(A7)* E2(B8)* E3(A8)*; U?#30 11(SDIO_INT_)*; U?#31 3(PG)*; U?#32 4(BP)*

### Notes on the sheet
- (near U?#29) ERROR!!! Compare with WF60 Datasheet
- (near U?#30) WIFI VCC is +3.7V
- TITLE:
- DOCUMENT NAME:
- SCALE 1:1
- This document is copyright of EsteemPCB and shall not be revealed, produced, copied, in whole or in part, nor
- PROJECT CODE:
- TEMPLATE:
- A4
- AUTHOR:
- Sheet
- of
- used for any purpose other than submitted.

### Library data of the parts
C?#221-C?#223 C?#225-C?#227 C?#229 = CAP_100nF-25V-10%-0201: as C?#122-C?#127 on sheet [8]-LPDDR4 SDRAM-1; Case/Package: 0201; Supplier-1: Digikey
C?#224 C?#228 = CAP_10uF-10V-10%-0603: as C?#210 on sheet [10]-EMMC Chip; Case/Package: 0603; Supplier-1: Digikey
C?#230 C?#231 = CAP_1uF-16V-10%-0201: as C?#121 on sheet [8]-LPDDR4 SDRAM-1; Case/Package: 0201; Supplier-1: Digikey
J?#1 J?#2 = CON-PLG_3X1-ECT818000071-ST-SMD: SMD RF Connectors/Coaxial Connectors RoHS; Manufacturer: ECT; Manufacturer Part Number: ECT818000071; Case/Package: SMD; Supplier-1: LCSC
R?#56-R?#58 R?#60 = RES_10K-0.05W-1%-0201: as R?#47 on sheet [8]-LPDDR4 SDRAM-1; Case/Package: 0201; Supplier-1: Digikey
R?#59 = RES_40.2K-0.05W-1%-0201: 40.2 kOhms ±1% 0.05W, 1/20W Chip Resistor 0201 (0603 Metric) Automotive AEC-Q200, Moisture Resistant Thick Film /; Manufacturer: Yageo; Manufacturer Part Number: AC0201FR-0740K2L; Case/Package: 0201; Supplier-1: Digikey
R?#61 = RES_1K-0.05W-1%-0201: 1 kOhms ±1% 0.05W, 1/20W Chip Resistor 0201 (0603 Metric) Thick Film /; Manufacturer: Yageo; Manufacturer Part Number: RC0201FR-071KL; Case/Package: 0201; Supplier-1: Digikey
U?#29 = IC_TXB0108NMER: Translation - Voltage Levels 8-Bit Bidirectional Voltage-Level Shifter with Auto Direction Sensing and +/-15-kV ESD Protect; Manufacturer: Texas Instruments; Manufacturer Part Number: TXB0108NMER; Case/Package: NFBGA-20; Supplier-1: Mouser
U?#30 = MOD_WF60-SMD: Amp’ed RF Tech presents the WF60 WiFi dual / band module: 802.11abgn.; Nymble Part Number: 1EA-AA-0568; Alternate Part Number-1: NA; Manufacturer: Amp’ed; Manufacturer Part Number: WF60; Case/Package: SMD; Supplier-1: Arrow; Supplier Part Number-1: WF60; Category: Module; Number of Pins: 16
U?#31 = REG_5.5V-0~5.1V-0.5A-2.55W-DFN-6: Adjustable 5.5V 0.8V 500mA DFN-6 Linear Voltage Regulators RoHS; Manufacturer: STMicroelectronics; Nymble Part Number: 1EA-AA-0572; Alternate Part Number-1: NA; Manufacturer Part Number: LD39050PUR; Case/Package: DFN-6; Supplier-1: LCSC; Supplier Part Number-1: C222094; Category: Regulators; Number of Pins: 6
U?#32 = REG_1.8V-300mA-5.5V-SC70-5: Linear Voltage Regulator IC 1 Output 300mA SC-70-5; Manufacturer: Richtek USA Inc.; Manufacturer Part Number: RT9193-18GU5; Case/Package: SC70-5; Supplier-1: Digikey
Y? = XTAL_ECS-327MVATX-2-CN-TR: 32.768kHz XO (Standard) CMOS Oscillator 1.6V ~ 3.6V Enable/Disable 4-SMD, No Lead; Manufacturer: ECS INC; Nymble Part Number: 1EA-AA-0561; Alternate Part Number-1: NA; Manufacturer Part Number: ECS-327MVATX-3-CN-TR; Case/Package: SMD-4; Supplier-1: Digikey; Supplier Part Number-1: ECS-327MVATX-3-CN-TR; Category: Crystal; Number of Pins: 4